# Altium project LPCB235__RLOOP__FCU.PrjPCB (part 1 of 7)
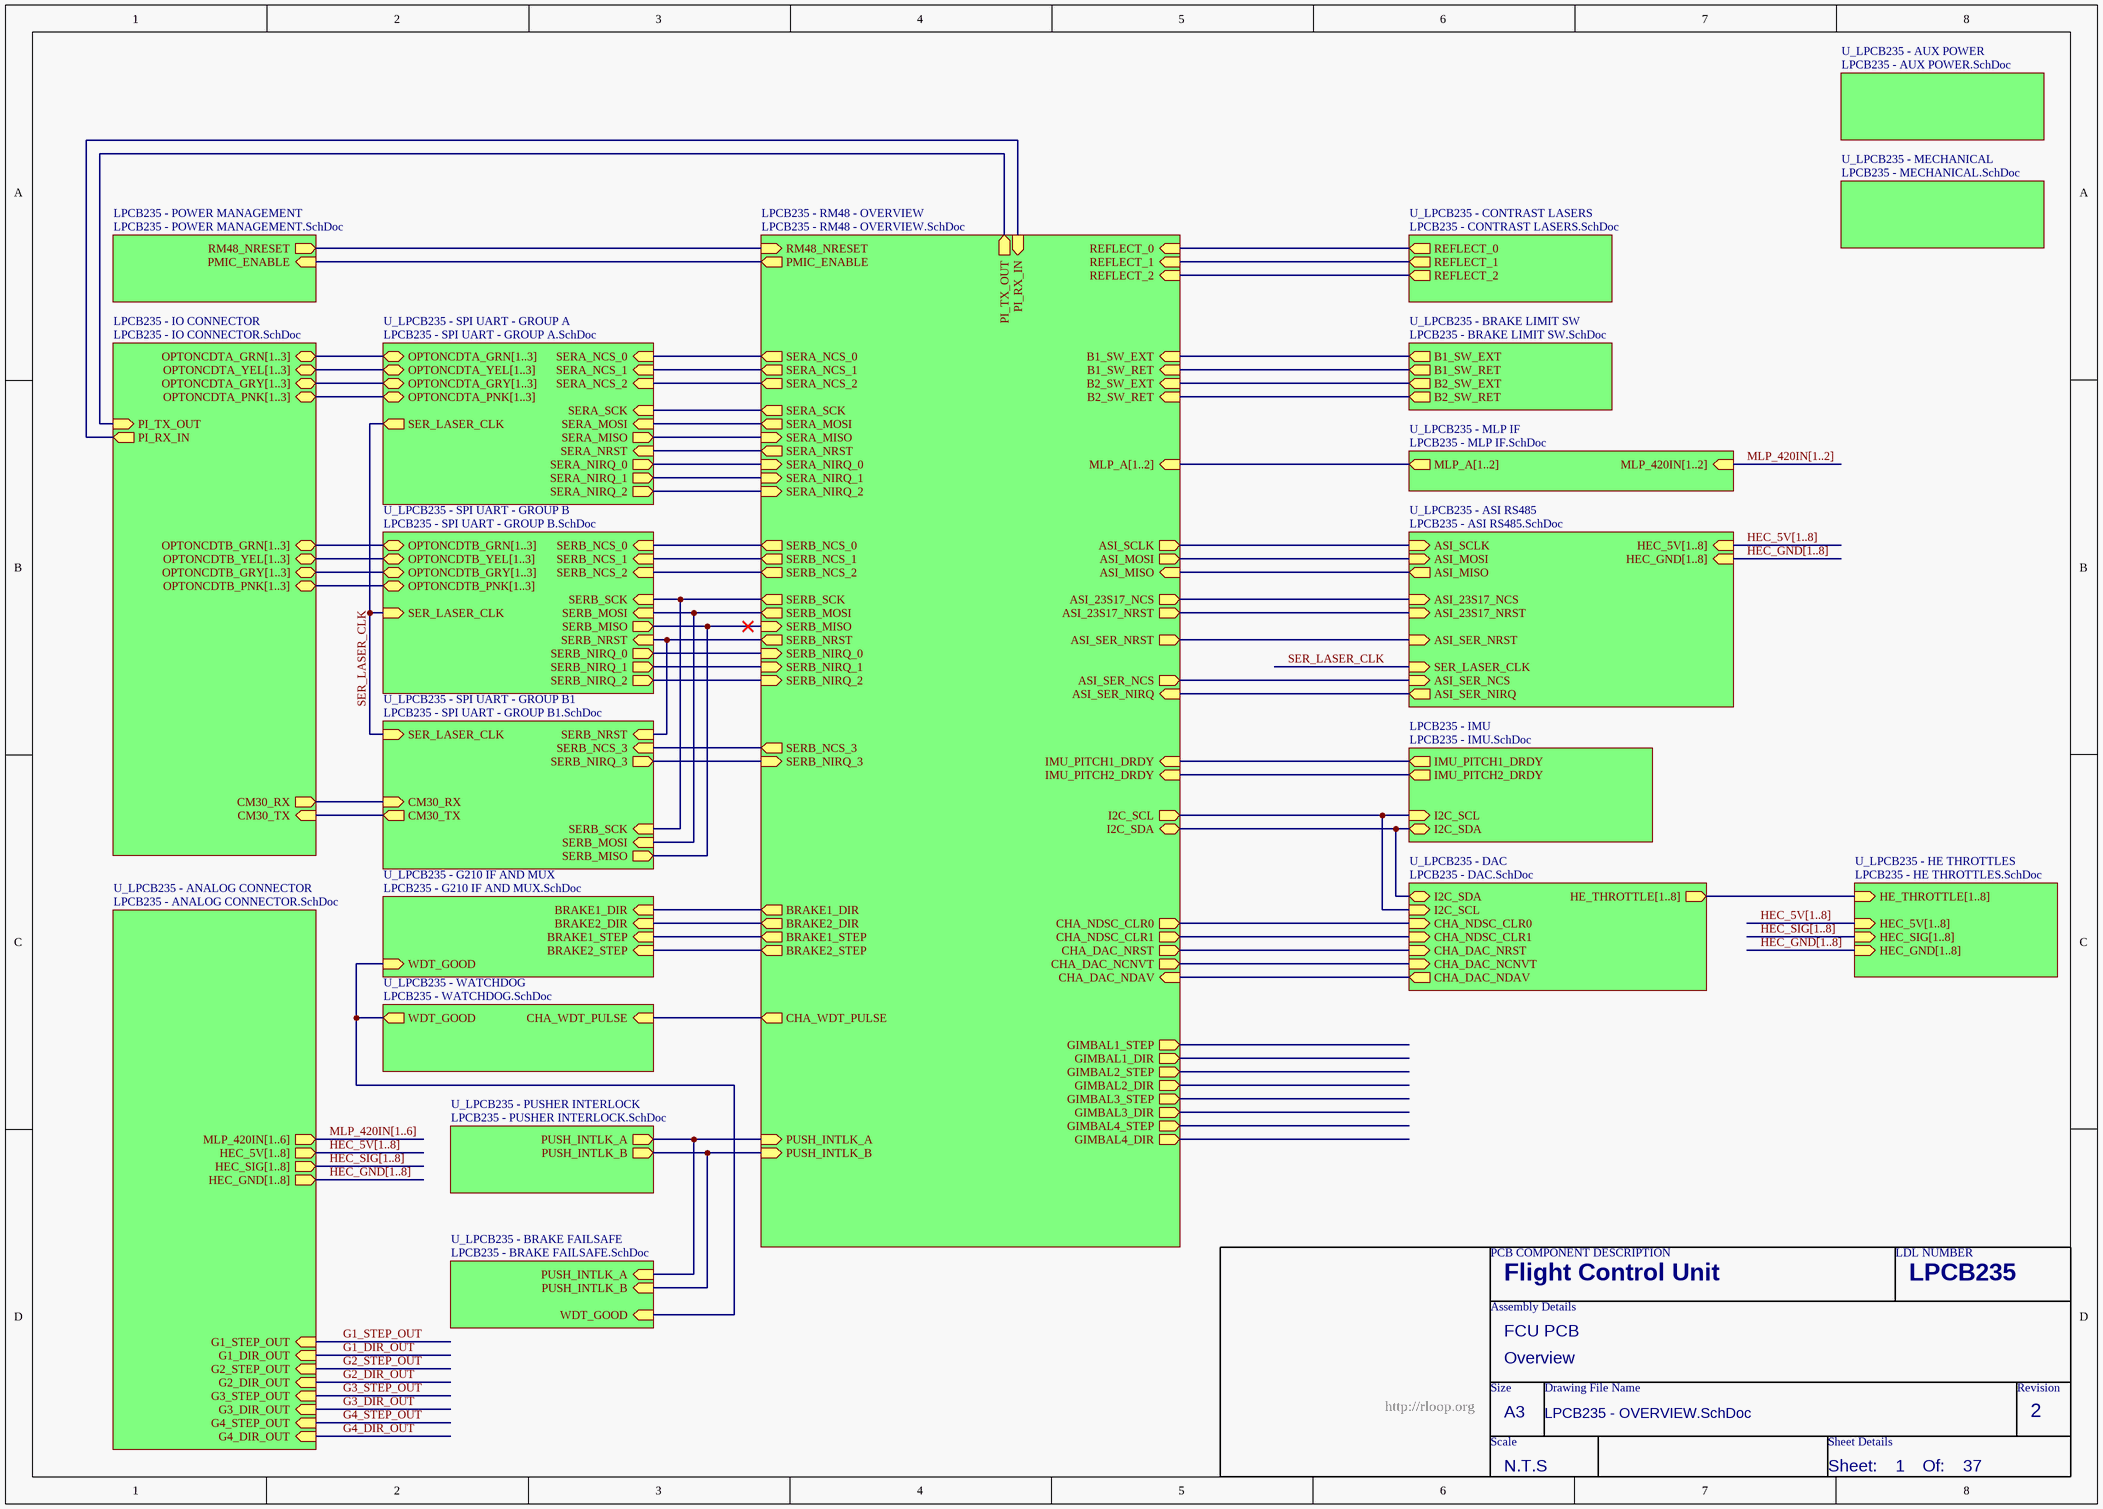
[diagram p0: LPCB235 - OVERVIEW.SchDoc]
37 sheets, 472 parts. Net scope: hierarchical (ports join the sheet entries above them; power ports are global).
Board files: LPCB235R0.PcbDoc, LPCB235R0__ASCII.PcbDoc
Sheets:
  LPCB235 - OVERVIEW.SchDoc
    LPCB235 - POWER MANAGEMENT = LPCB235 - POWER MANAGEMENT.SchDoc
    LPCB235 - IO CONNECTOR = LPCB235 - IO Connector.SchDoc
    LPCB235 - RM48 - OVERVIEW = LPCB235 - RM48 - OVERVIEW.SchDoc
      LPCB235 - RM48 - POWER = LPCB235 - RM48 - POWER.SchDoc
      LPCB235 - RM48 - ANALOG = LPCB235 - RM48 - ANALOG.SchDoc
      LPCB235 - RM48 - EMIF = LPCB235 - RM48 - EMIF.SchDoc
      LPCB235 - RM48 - MAIN = LPCB235 - RM48 - MAIN.SchDoc
      LPCB235 - CAN Interface = LPCB235 - CAN Interface.SchDoc
      LPCB235 - RM48 - SERIAL = LPCB235 - RM48 - SERIAL.SchDoc
      LPCB235 - RM48 - 100BASET = LPCB235 - RM48 - 100BASET.SchDoc
      LPCB235 - MAGNETICS = LPCB235 - MAGNETICS.SchDoc
      LPCB235 - RM48 - GIO = LPCB235 - RM48 - GIO.SchDoc
      LPCB235 - RM48 - N2HET = LPCB235 - RM48 - N2HET.SchDoc
    LPCB235 - IMU = LPCB235 - IMU.SchDoc
    U_LPCB235 - MECHANICAL = LPCB235 - MECHANICAL.SchDoc
    U_LPCB235 - SPI UART - GROUP B = LPCB235 - SPI UART - GROUP B.SchDoc
      OGB1 = LPCB235 - OPTONCDT - GROUP B.SchDoc
      OGB2 = LPCB235 - OPTONCDT - GROUP B.SchDoc
      OGB3 = LPCB235 - OPTONCDT - GROUP B.SchDoc
    U_LPCB235 - SPI UART - GROUP A = LPCB235 - SPI UART - GROUP A.SchDoc
      OGA1 = LPCB235 - OPTONCDT - GROUP A.SchDoc
      OGA2 = LPCB235 - OPTONCDT - GROUP A.SchDoc
      OGA3 = LPCB235 - OPTONCDT - GROUP A.SchDoc
    U_LPCB235 - SPI UART - GROUP B1 = LPCB235 - SPI UART - GROUP B1.SchDoc
    U_LPCB235 - DAC = LPCB235 - DAC.SchDoc
    U_LPCB235 - HE THROTTLES = LPCB235 - HE THROTTLES.SchDoc
      TH1 = LPCB235 - HE ISO CHANNEL.SchDoc
      TH2 = LPCB235 - HE ISO CHANNEL.SchDoc
      TH3 = LPCB235 - HE ISO CHANNEL.SchDoc
      TH4 = LPCB235 - HE ISO CHANNEL.SchDoc
      TH5 = LPCB235 - HE ISO CHANNEL.SchDoc
      TH6 = LPCB235 - HE ISO CHANNEL.SchDoc
      TH7 = LPCB235 - HE ISO CHANNEL.SchDoc
      TH8 = LPCB235 - HE ISO CHANNEL.SchDoc
    U_LPCB235 - WATCHDOG = LPCB235 - WATCHDOG.SchDoc
    U_LPCB235 - BRAKE FAILSAFE = LPCB235 - BRAKE FAILSAFE.SchDoc
    U_LPCB235 - ANALOG CONNECTOR = LPCB235 - ANALOG CONNECTOR.SchDoc
    U_LPCB235 - CONTRAST LASERS = LPCB235 - CONTRAST LASERS.SchDoc
    U_LPCB235 - PUSHER INTERLOCK = LPCB235 - PUSHER INTERLOCK.SchDoc
    U_LPCB235 - BRAKE LIMIT SW = LPCB235 - BRAKE LIMIT SW.SchDoc
    U_LPCB235 - AUX POWER = LPCB235 - AUX POWER.SchDoc
    U_LPCB235 - G210 IF AND MUX = LPCB235 - G210 IF AND MUX.SchDoc
    U_LPCB235 - MLP IF = LPCB235 - MLP IF.SchDoc
      ML1 = LPCB235 - MLP CHANNEL.SchDoc
      ML2 = LPCB235 - MLP CHANNEL.SchDoc
    U_LPCB235 - ASI RS485 = LPCB235 - ASI RS485.SchDoc
      U_LPCB235 - HEC1-4 = LPCB235 - HEC1-4.SchDoc
      U_LPCB235 - HEC5-8 = LPCB235 - HEC5-8.SchDoc

## Sheet LPCB235 - OVERVIEW.SchDoc
size A3; Address1: Unit 4; DocumentNumber: 1; Revision: 2; SheetNumber: 1; SheetTotal: 37; Lockie__PCB_SUB_ASSEMBLY: Overview; Lockie__PCB_ASSEMBLY: FCU PCB; Lockie__LDL: LPCB235; Lockie__PCB_DESCRIPTION: Flight Control Unit

### Sub-sheets
LPCB235 - IMU = LPCB235 - IMU.SchDoc: IMU_PITCH1_DRDY (out), IMU_PITCH2_DRDY (out), I2C_SCL (in), I2C_SDA (bidir)
LPCB235 - IO CONNECTOR = LPCB235 - IO CONNECTOR.SchDoc: OPTONCDTA_GRN[1..3] (bidir), OPTONCDTA_YEL[1..3] (bidir), OPTONCDTA_GRY[1..3] (bidir), OPTONCDTA_PNK[1..3] (bidir), OPTONCDTB_GRN[1..3] (bidir), OPTONCDTB_YEL[1..3] (bidir), OPTONCDTB_GRY[1..3] (bidir), OPTONCDTB_PNK[1..3] (bidir), CM30_RX (out), CM30_TX (in), PI_TX_OUT (in), PI_RX_IN (out)
LPCB235 - POWER MANAGEMENT = LPCB235 - POWER MANAGEMENT.SchDoc: PMIC_ENABLE (in), RM48_NRESET (out)
LPCB235 - RM48 - OVERVIEW = LPCB235 - RM48 - OVERVIEW.SchDoc: RM48_NRESET (in), PMIC_ENABLE (out), SERA_NRST (out), SERB_NRST (out), REFLECT_0 (in), REFLECT_1 (in), REFLECT_2 (in), MLP_A[1..2] (in), SERA_NIRQ_0 (in), SERA_NIRQ_1 (in), SERA_NIRQ_2 (in), SERA_NCS_0 (out), SERA_NCS_1 (out), SERA_NCS_2 (out), SERA_MISO (in), SERA_MOSI (out), SERA_SCK (out), IMU_PITCH1_DRDY (in), IMU_PITCH2_DRDY (in), SERB_MISO (in), SERB_MOSI (out), SERB_SCK (out), BRAKE2_DIR (out), BRAKE1_DIR (out), BRAKE2_STEP (out), BRAKE1_STEP (out), SERB_NCS_0 (out), SERB_NCS_1 (out), SERB_NIRQ_1 (in), CHA_WDT_PULSE (out), SERB_NIRQ_0 (in), I2C_SCL (out), I2C_SDA (bidir), PUSH_INTLK_A (in), B2_SW_EXT (in), SERB_NCS_2 (out), SERB_NCS_3 (out), SERB_NIRQ_2 (in), SERB_NIRQ_3 (in), PUSH_INTLK_B (in), B2_SW_RET (in), CHA_DAC_NDAV (in), B1_SW_EXT (in), B1_SW_RET (in), CHA_DAC_NRST (out), CHA_NDSC_CLR0 (out), CHA_NDSC_CLR1 (out), PI_TX_OUT (out), PI_RX_IN (in), CHA_DAC_NCNVT (out), ASI_MISO (in), ASI_MOSI (out), ASI_SCLK (out), ASI_23S17_NCS (out), ASI_23S17_NRST (out), ASI_SER_NCS (out), ASI_SER_NIRQ (in), ASI_SER_NRST (out), GIMBAL1_STEP (out), GIMBAL1_DIR (out), GIMBAL2_STEP (out), GIMBAL2_DIR (out), GIMBAL3_STEP (out), GIMBAL3_DIR (out), GIMBAL4_STEP (out), GIMBAL4_DIR (out)
U_LPCB235 - ANALOG CONNECTOR = LPCB235 - ANALOG CONNECTOR.SchDoc: HEC_5V[1..8] (out), HEC_SIG[1..8] (out), HEC_GND[1..8] (out), MLP_420IN[1..6] (out), G1_STEP_OUT (in), G1_DIR_OUT (in), G2_STEP_OUT (in), G2_DIR_OUT (in), G3_STEP_OUT (in), G3_DIR_OUT (in), G4_STEP_OUT (in), G4_DIR_OUT (in)
U_LPCB235 - ASI RS485 = LPCB235 - ASI RS485.SchDoc: ASI_SCLK (in), ASI_MOSI (in), ASI_MISO (out), ASI_23S17_NCS (in), ASI_23S17_NRST (in), SER_LASER_CLK (in), ASI_SER_NCS (in), ASI_SER_NRST (in), ASI_SER_NIRQ (out), HEC_5V[1..8] (in), HEC_GND[1..8] (in)
U_LPCB235 - AUX POWER = LPCB235 - AUX POWER.SchDoc: no entries
U_LPCB235 - BRAKE FAILSAFE = LPCB235 - BRAKE FAILSAFE.SchDoc: PUSH_INTLK_A (in), PUSH_INTLK_B (in), WDT_GOOD (in)
U_LPCB235 - BRAKE LIMIT SW = LPCB235 - BRAKE LIMIT SW.SchDoc: B1_SW_EXT (out), B1_SW_RET (out), B2_SW_EXT (out), B2_SW_RET (out)
U_LPCB235 - CONTRAST LASERS = LPCB235 - CONTRAST LASERS.SchDoc: REFLECT_0 (out), REFLECT_1 (out), REFLECT_2 (out)
U_LPCB235 - DAC = LPCB235 - DAC.SchDoc: HE_THROTTLE[1..8] (out), I2C_SDA (bidir), I2C_SCL (in), CHA_NDSC_CLR0 (in), CHA_NDSC_CLR1 (in), CHA_DAC_NRST (in), CHA_DAC_NDAV (out), CHA_DAC_NCNVT (in)
U_LPCB235 - G210 IF AND MUX = LPCB235 - G210 IF AND MUX.SchDoc: BRAKE1_DIR (in), BRAKE2_DIR (in), BRAKE1_STEP (in), BRAKE2_STEP (in), WDT_GOOD (in)
U_LPCB235 - HE THROTTLES = LPCB235 - HE THROTTLES.SchDoc: HE_THROTTLE[1..8] (in), HEC_5V[1..8] (in), HEC_SIG[1..8] (in), HEC_GND[1..8] (in)
U_LPCB235 - MECHANICAL = LPCB235 - MECHANICAL.SchDoc: no entries
U_LPCB235 - MLP IF = LPCB235 - MLP IF.SchDoc: MLP_A[1..2] (out), MLP_420IN[1..2] (in)
U_LPCB235 - PUSHER INTERLOCK = LPCB235 - PUSHER INTERLOCK.SchDoc: PUSH_INTLK_A (out), PUSH_INTLK_B (out)
U_LPCB235 - SPI UART - GROUP A = LPCB235 - SPI UART - GROUP A.SchDoc: SERA_NCS_0 (in), SERA_NCS_1 (in), SERA_NCS_2 (in), SERA_NRST (in), SERA_NIRQ_0 (out), SERA_NIRQ_1 (out), SERA_NIRQ_2 (out), SERA_SCK (in), SERA_MOSI (in), SERA_MISO (out), OPTONCDTA_GRN[1..3] (bidir), OPTONCDTA_YEL[1..3] (bidir), OPTONCDTA_GRY[1..3] (bidir), OPTONCDTA_PNK[1..3] (bidir), SER_LASER_CLK (out)
U_LPCB235 - SPI UART - GROUP B = LPCB235 - SPI UART - GROUP B.SchDoc: SERB_NCS_0 (in), SERB_NCS_1 (in), SERB_NCS_2 (in), SERB_NRST (in), SERB_NIRQ_0 (out), SERB_NIRQ_1 (out), SERB_NIRQ_2 (out), SERB_SCK (in), SERB_MOSI (in), SERB_MISO (out), OPTONCDTB_GRN[1..3] (bidir), OPTONCDTB_YEL[1..3] (bidir), OPTONCDTB_GRY[1..3] (bidir), OPTONCDTB_PNK[1..3] (bidir), SER_LASER_CLK (in)
U_LPCB235 - SPI UART - GROUP B1 = LPCB235 - SPI UART - GROUP B1.SchDoc: SERB_NCS_3 (in), SERB_NRST (in), SERB_NIRQ_3 (out), SERB_SCK (in), SERB_MOSI (in), SERB_MISO (out), SER_LASER_CLK (in), CM30_RX (in), CM30_TX (out)
U_LPCB235 - WATCHDOG = LPCB235 - WATCHDOG.SchDoc: CHA_WDT_PULSE (in), WDT_GOOD (out)

### Nets
ASI_23S17_NCS: sheet LPCB235 - RM48 - OVERVIEW/ASI_23S17_NCS, sheet U_LPCB235 - ASI RS485/ASI_23S17_NCS
ASI_23S17_NRST: sheet LPCB235 - RM48 - OVERVIEW/ASI_23S17_NRST, sheet U_LPCB235 - ASI RS485/ASI_23S17_NRST
ASI_MISO: sheet LPCB235 - RM48 - OVERVIEW/ASI_MISO, sheet U_LPCB235 - ASI RS485/ASI_MISO
ASI_MOSI: sheet LPCB235 - RM48 - OVERVIEW/ASI_MOSI, sheet U_LPCB235 - ASI RS485/ASI_MOSI
ASI_SCLK: sheet LPCB235 - RM48 - OVERVIEW/ASI_SCLK, sheet U_LPCB235 - ASI RS485/ASI_SCLK
ASI_SER_NCS: sheet LPCB235 - RM48 - OVERVIEW/ASI_SER_NCS, sheet U_LPCB235 - ASI RS485/ASI_SER_NCS
ASI_SER_NIRQ: sheet LPCB235 - RM48 - OVERVIEW/ASI_SER_NIRQ, sheet U_LPCB235 - ASI RS485/ASI_SER_NIRQ
ASI_SER_NRST: sheet LPCB235 - RM48 - OVERVIEW/ASI_SER_NRST, sheet U_LPCB235 - ASI RS485/ASI_SER_NRST
B1_SW_EXT: sheet LPCB235 - RM48 - OVERVIEW/B1_SW_EXT, sheet U_LPCB235 - BRAKE LIMIT SW/B1_SW_EXT
B1_SW_RET: sheet LPCB235 - RM48 - OVERVIEW/B1_SW_RET, sheet U_LPCB235 - BRAKE LIMIT SW/B1_SW_RET
B2_SW_EXT: sheet LPCB235 - RM48 - OVERVIEW/B2_SW_EXT, sheet U_LPCB235 - BRAKE LIMIT SW/B2_SW_EXT
B2_SW_RET: sheet LPCB235 - RM48 - OVERVIEW/B2_SW_RET, sheet U_LPCB235 - BRAKE LIMIT SW/B2_SW_RET
BRAKE1_DIR: sheet LPCB235 - RM48 - OVERVIEW/BRAKE1_DIR, sheet U_LPCB235 - G210 IF AND MUX/BRAKE1_DIR
BRAKE1_STEP: sheet LPCB235 - RM48 - OVERVIEW/BRAKE1_STEP, sheet U_LPCB235 - G210 IF AND MUX/BRAKE1_STEP
BRAKE2_DIR: sheet LPCB235 - RM48 - OVERVIEW/BRAKE2_DIR, sheet U_LPCB235 - G210 IF AND MUX/BRAKE2_DIR
BRAKE2_STEP: sheet LPCB235 - RM48 - OVERVIEW/BRAKE2_STEP, sheet U_LPCB235 - G210 IF AND MUX/BRAKE2_STEP
CHA_DAC_NCNVT: sheet LPCB235 - RM48 - OVERVIEW/CHA_DAC_NCNVT, sheet U_LPCB235 - DAC/CHA_DAC_NCNVT
CHA_DAC_NDAV: sheet LPCB235 - RM48 - OVERVIEW/CHA_DAC_NDAV, sheet U_LPCB235 - DAC/CHA_DAC_NDAV
CHA_DAC_NRST: sheet LPCB235 - RM48 - OVERVIEW/CHA_DAC_NRST, sheet U_LPCB235 - DAC/CHA_DAC_NRST
CHA_NDSC_CLR0: sheet LPCB235 - RM48 - OVERVIEW/CHA_NDSC_CLR0, sheet U_LPCB235 - DAC/CHA_NDSC_CLR0
CHA_NDSC_CLR1: sheet LPCB235 - RM48 - OVERVIEW/CHA_NDSC_CLR1, sheet U_LPCB235 - DAC/CHA_NDSC_CLR1
CHA_WDT_PULSE: sheet LPCB235 - RM48 - OVERVIEW/CHA_WDT_PULSE, sheet U_LPCB235 - WATCHDOG/CHA_WDT_PULSE
CM30_RX: sheet LPCB235 - IO CONNECTOR/CM30_RX, sheet U_LPCB235 - SPI UART - GROUP B1/CM30_RX
CM30_TX: sheet LPCB235 - IO CONNECTOR/CM30_TX, sheet U_LPCB235 - SPI UART - GROUP B1/CM30_TX
I2C_SCL: sheet LPCB235 - RM48 - OVERVIEW/I2C_SCL, sheet LPCB235 - IMU/I2C_SCL, sheet U_LPCB235 - DAC/I2C_SCL
I2C_SDA: sheet LPCB235 - RM48 - OVERVIEW/I2C_SDA, sheet LPCB235 - IMU/I2C_SDA, sheet U_LPCB235 - DAC/I2C_SDA
IMU_PITCH1_DRDY: sheet LPCB235 - RM48 - OVERVIEW/IMU_PITCH1_DRDY, sheet LPCB235 - IMU/IMU_PITCH1_DRDY
IMU_PITCH2_DRDY: sheet LPCB235 - RM48 - OVERVIEW/IMU_PITCH2_DRDY, sheet LPCB235 - IMU/IMU_PITCH2_DRDY
PI_RX_IN: sheet LPCB235 - IO CONNECTOR/PI_RX_IN, sheet LPCB235 - RM48 - OVERVIEW/PI_RX_IN
PI_TX_OUT: sheet LPCB235 - IO CONNECTOR/PI_TX_OUT, sheet LPCB235 - RM48 - OVERVIEW/PI_TX_OUT
PMIC_ENABLE: sheet LPCB235 - POWER MANAGEMENT/PMIC_ENABLE, sheet LPCB235 - RM48 - OVERVIEW/PMIC_ENABLE
PUSH_INTLK_A: sheet LPCB235 - RM48 - OVERVIEW/PUSH_INTLK_A, sheet U_LPCB235 - BRAKE FAILSAFE/PUSH_INTLK_A, sheet U_LPCB235 - PUSHER INTERLOCK/PUSH_INTLK_A
PUSH_INTLK_B: sheet LPCB235 - RM48 - OVERVIEW/PUSH_INTLK_B, sheet U_LPCB235 - BRAKE FAILSAFE/PUSH_INTLK_B, sheet U_LPCB235 - PUSHER INTERLOCK/PUSH_INTLK_B
REFLECT_0: sheet LPCB235 - RM48 - OVERVIEW/REFLECT_0, sheet U_LPCB235 - CONTRAST LASERS/REFLECT_0
REFLECT_1: sheet LPCB235 - RM48 - OVERVIEW/REFLECT_1, sheet U_LPCB235 - CONTRAST LASERS/REFLECT_1
REFLECT_2: sheet LPCB235 - RM48 - OVERVIEW/REFLECT_2, sheet U_LPCB235 - CONTRAST LASERS/REFLECT_2
RM48_NRESET: sheet LPCB235 - POWER MANAGEMENT/RM48_NRESET, sheet LPCB235 - RM48 - OVERVIEW/RM48_NRESET
SER_LASER_CLK: sheet U_LPCB235 - SPI UART - GROUP B/SER_LASER_CLK, sheet U_LPCB235 - SPI UART - GROUP A/SER_LASER_CLK, sheet U_LPCB235 - SPI UART - GROUP B1/SER_LASER_CLK, sheet U_LPCB235 - ASI RS485/SER_LASER_CLK
SERA_MISO: sheet LPCB235 - RM48 - OVERVIEW/SERA_MISO, sheet U_LPCB235 - SPI UART - GROUP A/SERA_MISO
SERA_MOSI: sheet LPCB235 - RM48 - OVERVIEW/SERA_MOSI, sheet U_LPCB235 - SPI UART - GROUP A/SERA_MOSI
SERA_NCS_0: sheet LPCB235 - RM48 - OVERVIEW/SERA_NCS_0, sheet U_LPCB235 - SPI UART - GROUP A/SERA_NCS_0
SERA_NCS_1: sheet LPCB235 - RM48 - OVERVIEW/SERA_NCS_1, sheet U_LPCB235 - SPI UART - GROUP A/SERA_NCS_1
SERA_NCS_2: sheet LPCB235 - RM48 - OVERVIEW/SERA_NCS_2, sheet U_LPCB235 - SPI UART - GROUP A/SERA_NCS_2
SERA_NIRQ_0: sheet LPCB235 - RM48 - OVERVIEW/SERA_NIRQ_0, sheet U_LPCB235 - SPI UART - GROUP A/SERA_NIRQ_0
SERA_NIRQ_1: sheet LPCB235 - RM48 - OVERVIEW/SERA_NIRQ_1, sheet U_LPCB235 - SPI UART - GROUP A/SERA_NIRQ_1
SERA_NIRQ_2: sheet LPCB235 - RM48 - OVERVIEW/SERA_NIRQ_2, sheet U_LPCB235 - SPI UART - GROUP A/SERA_NIRQ_2
SERA_NRST: sheet LPCB235 - RM48 - OVERVIEW/SERA_NRST, sheet U_LPCB235 - SPI UART - GROUP A/SERA_NRST
SERA_SCK: sheet LPCB235 - RM48 - OVERVIEW/SERA_SCK, sheet U_LPCB235 - SPI UART - GROUP A/SERA_SCK
SERB_MISO: sheet LPCB235 - RM48 - OVERVIEW/SERB_MISO, sheet U_LPCB235 - SPI UART - GROUP B/SERB_MISO, sheet U_LPCB235 - SPI UART - GROUP B1/SERB_MISO
SERB_MOSI: sheet LPCB235 - RM48 - OVERVIEW/SERB_MOSI, sheet U_LPCB235 - SPI UART - GROUP B/SERB_MOSI, sheet U_LPCB235 - SPI UART - GROUP B1/SERB_MOSI
SERB_NCS_0: sheet LPCB235 - RM48 - OVERVIEW/SERB_NCS_0, sheet U_LPCB235 - SPI UART - GROUP B/SERB_NCS_0
SERB_NCS_1: sheet LPCB235 - RM48 - OVERVIEW/SERB_NCS_1, sheet U_LPCB235 - SPI UART - GROUP B/SERB_NCS_1
SERB_NCS_2: sheet LPCB235 - RM48 - OVERVIEW/SERB_NCS_2, sheet U_LPCB235 - SPI UART - GROUP B/SERB_NCS_2
SERB_NCS_3: sheet LPCB235 - RM48 - OVERVIEW/SERB_NCS_3, sheet U_LPCB235 - SPI UART - GROUP B1/SERB_NCS_3
SERB_NIRQ_0: sheet LPCB235 - RM48 - OVERVIEW/SERB_NIRQ_0, sheet U_LPCB235 - SPI UART - GROUP B/SERB_NIRQ_0
SERB_NIRQ_1: sheet LPCB235 - RM48 - OVERVIEW/SERB_NIRQ_1, sheet U_LPCB235 - SPI UART - GROUP B/SERB_NIRQ_1
SERB_NIRQ_2: sheet LPCB235 - RM48 - OVERVIEW/SERB_NIRQ_2, sheet U_LPCB235 - SPI UART - GROUP B/SERB_NIRQ_2
SERB_NIRQ_3: sheet LPCB235 - RM48 - OVERVIEW/SERB_NIRQ_3, sheet U_LPCB235 - SPI UART - GROUP B1/SERB_NIRQ_3
SERB_NRST: sheet LPCB235 - RM48 - OVERVIEW/SERB_NRST, sheet U_LPCB235 - SPI UART - GROUP B/SERB_NRST, sheet U_LPCB235 - SPI UART - GROUP B1/SERB_NRST
SERB_SCK: sheet LPCB235 - RM48 - OVERVIEW/SERB_SCK, sheet U_LPCB235 - SPI UART - GROUP B/SERB_SCK, sheet U_LPCB235 - SPI UART - GROUP B1/SERB_SCK
WDT_GOOD: sheet U_LPCB235 - WATCHDOG/WDT_GOOD, sheet U_LPCB235 - BRAKE FAILSAFE/WDT_GOOD, sheet U_LPCB235 - G210 IF AND MUX/WDT_GOOD

### Buses and harness runs
bus HEC_5V[1..8] = sheet U_LPCB235 - ANALOG CONNECTOR/HEC_5V[1..8]
bus HEC_5V[1..8] = sheet U_LPCB235 - ASI RS485/HEC_5V[1..8]
bus HEC_5V[1..8] = sheet U_LPCB235 - HE THROTTLES/HEC_5V[1..8]
bus HEC_GND[1..8] = sheet U_LPCB235 - ANALOG CONNECTOR/HEC_GND[1..8]
bus HEC_GND[1..8] = sheet U_LPCB235 - ASI RS485/HEC_GND[1..8]
bus HEC_GND[1..8] = sheet U_LPCB235 - HE THROTTLES/HEC_GND[1..8]
bus HEC_SIG[1..8] = sheet U_LPCB235 - ANALOG CONNECTOR/HEC_SIG[1..8]
bus HEC_SIG[1..8] = sheet U_LPCB235 - HE THROTTLES/HEC_SIG[1..8]
bus MLP_420IN[1..2] = sheet U_LPCB235 - MLP IF/MLP_420IN[1..2]
bus MLP_420IN[1..6] = sheet U_LPCB235 - ANALOG CONNECTOR/MLP_420IN[1..6]
bus sheet LPCB235 - IO CONNECTOR/OPTONCDTA_GRN[1..3] = sheet U_LPCB235 - SPI UART - GROUP A/OPTONCDTA_GRN[1..3]
bus sheet LPCB235 - IO CONNECTOR/OPTONCDTA_GRY[1..3] = sheet U_LPCB235 - SPI UART - GROUP A/OPTONCDTA_GRY[1..3]
bus sheet LPCB235 - IO CONNECTOR/OPTONCDTA_PNK[1..3] = sheet U_LPCB235 - SPI UART - GROUP A/OPTONCDTA_PNK[1..3]
bus sheet LPCB235 - IO CONNECTOR/OPTONCDTA_YEL[1..3] = sheet U_LPCB235 - SPI UART - GROUP A/OPTONCDTA_YEL[1..3]
bus sheet LPCB235 - IO CONNECTOR/OPTONCDTB_GRN[1..3] = sheet U_LPCB235 - SPI UART - GROUP B/OPTONCDTB_GRN[1..3]
bus sheet LPCB235 - IO CONNECTOR/OPTONCDTB_GRY[1..3] = sheet U_LPCB235 - SPI UART - GROUP B/OPTONCDTB_GRY[1..3]
bus sheet LPCB235 - IO CONNECTOR/OPTONCDTB_PNK[1..3] = sheet U_LPCB235 - SPI UART - GROUP B/OPTONCDTB_PNK[1..3]
bus sheet LPCB235 - IO CONNECTOR/OPTONCDTB_YEL[1..3] = sheet U_LPCB235 - SPI UART - GROUP B/OPTONCDTB_YEL[1..3]
bus sheet LPCB235 - RM48 - OVERVIEW/MLP_A[1..2] = sheet U_LPCB235 - MLP IF/MLP_A[1..2]
bus sheet U_LPCB235 - DAC/HE_THROTTLE[1..8] = sheet U_LPCB235 - HE THROTTLES/HE_THROTTLE[1..8]

### Notes on the sheet
- PCB COMPONENT DESCRIPTION
- LDL NUMBER
- Assembly Details
- Size
- Drawing File Name
- Revision
- http://rloop.org
- Scale
- A3
- Sheet Details
- N.T.S
- Sheet:
- Of:

## Sheet LPCB235 - POWER MANAGEMENT.SchDoc
size A3; Address1: Unit 4; DocumentNumber: 19; Revision: 2; SheetNumber: 19; SheetTotal: 37; Lockie__PCB_SUB_ASSEMBLY: Power Management; Lockie__PCB_ASSEMBLY: FCU PCB; Lockie__LDL: LPCB235; Lockie__PCB_DESCRIPTION: Flight Control Unit
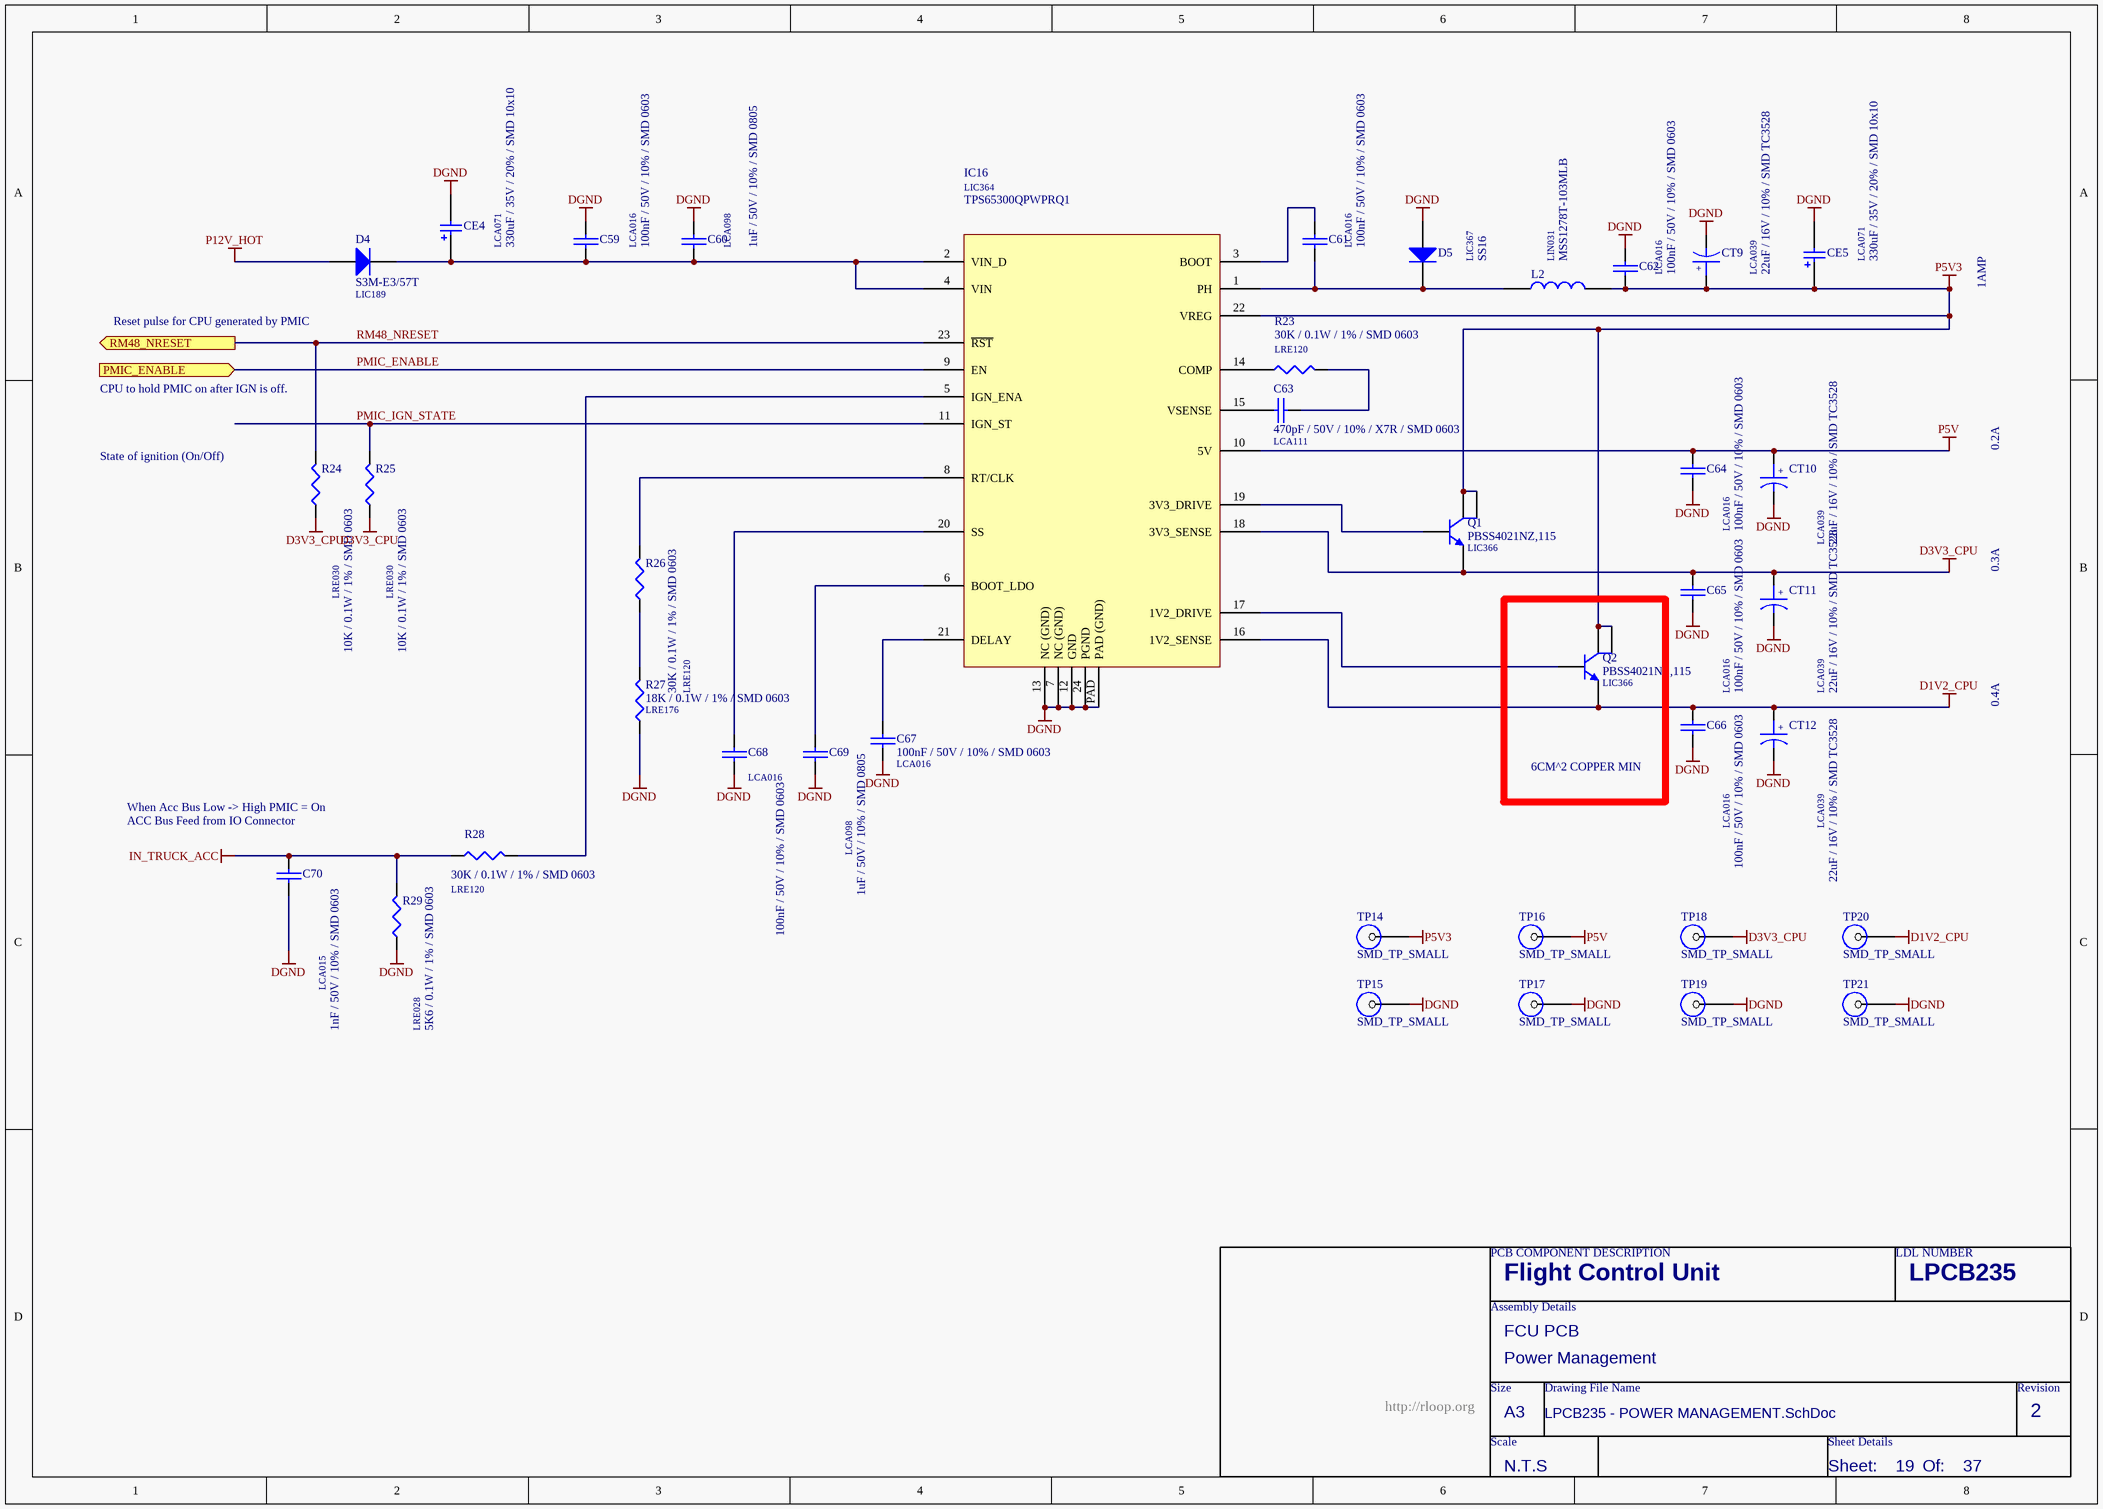
[diagram p1: LPCB235 - POWER MANAGEMENT.SchDoc]

### Parts
C59  100nF / 50V / 10% / SMD 0603  LDL_NUMBER: LCA016  [LFP011__CC1608-0603-IPC7351_B]
C60  1uF / 50V / 10% / SMD 0805  LDL_NUMBER: LCA098  [LFP010__CC2012-0805-IPC7351_B]
C61  100nF / 50V / 10% / SMD 0603  LDL_NUMBER: LCA016  [LFP011__CC1608-0603-IPC7351_B]
C62  100nF / 50V / 10% / SMD 0603  LDL_NUMBER: LCA016  [LFP011__CC1608-0603-IPC7351_B]
C63  470pF / 50V / 10% / X7R / SMD 0603  LDL_NUMBER: LCA111  [LFP011__CC1608-0603-IPC7351_B]
C64  100nF / 50V / 10% / SMD 0603  LDL_NUMBER: LCA016  [LFP011__CC1608-0603-IPC7351_B]
C65  100nF / 50V / 10% / SMD 0603  LDL_NUMBER: LCA016  [LFP011__CC1608-0603-IPC7351_B]
C66  100nF / 50V / 10% / SMD 0603  LDL_NUMBER: LCA016  [LFP011__CC1608-0603-IPC7351_B]
C67  100nF / 50V / 10% / SMD 0603  LDL_NUMBER: LCA016  [LFP011__CC1608-0603-IPC7351_B]
C68  100nF / 50V / 10% / SMD 0603  LDL_NUMBER: LCA016  [LFP011__CC1608-0603-IPC7351_B]
C69  1uF / 50V / 10% / SMD 0805  LDL_NUMBER: LCA098  [LFP010__CC2012-0805-IPC7351_B]
C70  1nF / 50V / 10% / SMD 0603  LDL_NUMBER: LCA015  [LFP011__CC1608-0603-IPC7351_B]
CE4  330uF / 35V / 20% / SMD 10x10  LDL_NUMBER: LCA071  [LFP041__NICHICON_WT_10X10]
CE5  330uF / 35V / 20% / SMD 10x10  LDL_NUMBER: LCA071  [LFP041__NICHICON_WT_10X10]
CT9  22uF / 16V / 10% / SMD TC3528  LDL_NUMBER: LCA039  [LFP018__TC3528]
CT10  22uF / 16V / 10% / SMD TC3528  LDL_NUMBER: LCA039  [LFP018__TC3528]
CT11  22uF / 16V / 10% / SMD TC3528  LDL_NUMBER: LCA039  [LFP018__TC3528]
CT12  22uF / 16V / 10% / SMD TC3528  LDL_NUMBER: LCA039  [LFP018__TC3528]
D4  S3M-E3/57T  LDL_NUMBER: LIC189  [LFP040__DO-214AB]
D5  SS16  LDL_NUMBER: LIC367  [LFP039__DO-214AC]
IC16  TPS65300QPWPRQ1  LDL_NUMBER: LIC364  [LFP036__R-PDSO-G24]
L2  MSS1278T-103MLB  LDL_NUMBER: LIN031  [LFP037__MSS1278T]
Q1  PBSS4021NZ,115  LDL_NUMBER: LIC366  [LFP038__SOT223-4M]
Q2  PBSS4021NZ,115  LDL_NUMBER: LIC366  [LFP038__SOT223-4M]
R23  30K / 0.1W / 1% / SMD 0603  LDL_NUMBER: LRE120  [LFP020__CR1608-0603-IPC7351_B]
R24  10K / 0.1W / 1% / SMD 0603  LDL_NUMBER: LRE030  [LFP020__CR1608-0603-IPC7351_B]
R25  10K / 0.1W / 1% / SMD 0603  LDL_NUMBER: LRE030  [LFP020__CR1608-0603-IPC7351_B]
R26  30K / 0.1W / 1% / SMD 0603  LDL_NUMBER: LRE120  [LFP020__CR1608-0603-IPC7351_B]
R27  18K / 0.1W / 1% / SMD 0603  LDL_NUMBER: LRE176  [LFP020__CR1608-0603-IPC7351_B]
R28  30K / 0.1W / 1% / SMD 0603  LDL_NUMBER: LRE120  [LFP020__CR1608-0603-IPC7351_B]
R29  5K6 / 0.1W / 1% / SMD 0603  LDL_NUMBER: LRE028  [LFP020__CR1608-0603-IPC7351_B]
TP14  SMD_TP_SMALL  [SMD-TP-SMALL]  (no BOM)
TP15  SMD_TP_SMALL  [SMD-TP-SMALL]  (no BOM)
TP16  SMD_TP_SMALL  [SMD-TP-SMALL]  (no BOM)
TP17  SMD_TP_SMALL  [SMD-TP-SMALL]  (no BOM)
TP18  SMD_TP_SMALL  [SMD-TP-SMALL]  (no BOM)
TP19  SMD_TP_SMALL  [SMD-TP-SMALL]  (no BOM)
TP20  SMD_TP_SMALL  [SMD-TP-SMALL]  (no BOM)
TP21  SMD_TP_SMALL  [SMD-TP-SMALL]  (no BOM)

### Blocks framed on the sheet
6CM^2 COPPER MIN: Q2

### Ports
PMIC_ENABLE (in), RM48_NRESET (out)

### Nets
D1V2_CPU: C66.1 CT12.1 IC16.16(1V2_SENSE) Q2.3(E) TP20.1
D3V3_CPU: C65.1 CT11.1 IC16.18(3V3_SENSE) Q1.3(E) R24.1 R25.1 TP18.1
DGND: C59.2 C60.2 C62.1 C64.2 C65.2 C66.2 C67.2 C68.1 C69.2 C70.2 CE4.2 CE5.2 CT9.2 CT10.2 CT11.2 CT12.2 D5.2(A) IC16.7(NC_(GND)) IC16.12(GND) IC16.13(NC_(GND)) IC16.24(PGND) IC16.PAD(PAD_(GND)) R27.1 R29.1 TP15.1 TP17.1 TP19.1 TP21.1
IN_TRUCK_ACC: C70.1 R28.1 R29.2
P5V: C64.1 CT10.1 IC16.10(5V) TP16.1
P5V3: C62.2 CE5.1 CT9.1 IC16.22(VREG) L2.2 Q1.2(C) Q1.4(C) Q2.2(C) Q2.4(C) TP14.1
P12V_HOT: D4.2(A)
PMIC_ENABLE: IC16.9(EN) ; port PMIC_ENABLE
PMIC_IGN_STATE: IC16.11(IGN_ST) R25.2
RM48_NRESET: IC16.23(~{RST}) R24.2 ; port RM48_NRESET
NetC59_1: C59.1 C60.1 CE4.1 D4.1(K) IC16.2(VIN_D) IC16.4(VIN)
NetC61_1: C61.1 D5.1(K) IC16.1(PH) L2.1
NetC61_2: C61.2 IC16.3(BOOT)
NetC63_1: C63.1 IC16.15(VSENSE)
NetC63_2: C63.2 R23.2
NetC67_1: C67.1 IC16.21(DELAY)
NetC68_2: C68.2 IC16.20(SS)
NetC69_1: C69.1 IC16.6(BOOT_LDO)
NetIC16_5: IC16.5(IGN_ENA) R28.2
NetIC16_8: IC16.8(RT/CLK) R26.2
NetIC16_14: IC16.14(COMP) R23.1
NetIC16_17: IC16.17(1V2_DRIVE) Q2.1(B)
NetIC16_19: IC16.19(3V3_DRIVE) Q1.1(B)
NetR26_1: R26.1 R27.2

### Notes on the sheet
- 1AMP
- Reset pulse for CPU generated by PMIC
- CPU to hold PMIC on after IGN is off.
- 0.2A
- State of ignition (On/Off)
- 0.3A
- 0.4A
- When Acc Bus Low -> High PMIC = On
- (near C70) ACC Bus Feed from IO Connector
- PCB COMPONENT DESCRIPTION
- LDL NUMBER
- Assembly Details
- Size
- Drawing File Name
- Revision
- http://rloop.org
- Scale
- A3
- Sheet Details
- N.T.S
- Sheet:
- Of:
- (in symbol 22uF / 16V / 10% / SMD TC3528) +

### Library data of the parts
C59 C61 C62 C64-C66 = 100nF / 50V / 10% / SMD 0603: Capacitor, Ceramic Chip, 100nF (0.1uF), 50V, 5%, SMD 0603 [LCA016]; Value: 100n; FMEDA__OPERATING__VOLTAGE_MIN: 0; FMEDA__OPERATING__VOLTAGE_MAX: 3.3; FMEDA__OPERATING__TEMP_MIN: -20; FMEDA__OPERATING__TEMP_TYP: 27; FMEDA__OPERATING__TEMP_MAX: 50; FMEDA__CHANNEL: COM; FMEDA__FUNCTION_IN_SYSTEM: *; FMEDA__OPERATING__VOLTAGE_TYP: 3.3
C60 = 1uF / 50V / 10% / SMD 0805: Capacitor, Ceramic Chip, 1uF, 50V, SMD 0805 [LCA098]; Value: 1u; FMEDA__OPERATING__VOLTAGE_MAX: 17; FMEDA__OPERATING__VOLTAGE_MIN: 0; FMEDA__OPERATING__TEMP_MAX: 50; FMEDA__OPERATING__TEMP_MIN: -20; FMEDA__OPERATING__TEMP_TYP: 27; FMEDA__OPERATING__VOLTAGE_TYP: 14; FMEDA__FUNCTION_IN_SYSTEM: POWER IN FILTER; FMEDA__CHANNEL: COM
C63 = 470pF / 50V / 10% / X7R / SMD 0603: Capacitor, Ceramic Chip, 470pF, 50V, 10% X7R, SMD 0603 [LCA111]; Value: 470p; FMEDA__OPERATING__TEMP_MAX: 50; FMEDA__OPERATING__TEMP_MIN: -20; FMEDA__OPERATING__TEMP_TYP: 27; FMEDA__OPERATING__VOLTAGE_MAX: 3.3; FMEDA__OPERATING__VOLTAGE_MIN: 0; FMEDA__FUNCTION_IN_SYSTEM: PMIC VSENSE CAP; FMEDA__CHANNEL: COM; FMEDA__OPERATING__VOLTAGE_TYP: 3.3
C67 C68 = 100nF / 50V / 10% / SMD 0603: Capacitor, Ceramic Chip, 100nF (0.1uF), 50V, 5%, SMD 0603 [LCA016]; Value: 100n; FMEDA__OPERATING__TEMP_MAX: 50; FMEDA__OPERATING__TEMP_MIN: -20; FMEDA__OPERATING__TEMP_TYP: 27; FMEDA__OPERATING__VOLTAGE_MAX: 3.3; FMEDA__OPERATING__VOLTAGE_MIN: 0; FMEDA__CHANNEL: COM; FMEDA__OPERATING__VOLTAGE_TYP: 3.3; FMEDA__FUNCTION_IN_SYSTEM: *
C69 = 1uF / 50V / 10% / SMD 0805: Capacitor, Ceramic Chip, 1uF, 50V, SMD 0805 [LCA098]; Value: 1u; FMEDA__OPERATING__VOLTAGE_MAX: 3.3; FMEDA__OPERATING__VOLTAGE_MIN: 0; FMEDA__OPERATING__TEMP_MAX: 50; FMEDA__OPERATING__TEMP_MIN: -20; FMEDA__OPERATING__TEMP_TYP: 27; FMEDA__FUNCTION_IN_SYSTEM: PMIC BOOT CAP; FMEDA__CHANNEL: COM; FMEDA__OPERATING__VOLTAGE_TYP: 3.3
C70 = 1nF / 50V / 10% / SMD 0603: Capacitor, Ceramic Chip, 1nF (1000pF), 50V, 10%, SMD 0603 [LCA015]; Value: 1n; FMEDA__FUNCTION_IN_SYSTEM: ACC BUS IN FILTER; FMEDA__OPERATING__TEMP_MAX: 50; FMEDA__OPERATING__TEMP_MIN: -20; FMEDA__OPERATING__TEMP_TYP: 27; FMEDA__OPERATING__VOLTAGE_MAX: 17; FMEDA__OPERATING__VOLTAGE_MIN: 0; FMEDA__OPERATING__VOLTAGE_TYP: 14; FMEDA__CHANNEL: COM
CE4 = 330uF / 35V / 20% / SMD 10x10: Capacitor, Aluminum Electrolytic, 330uF, 35V, 20%, SMD (10mm x 10mm); FMEDA__OPERATING__TEMP_MAX: 50; FMEDA__OPERATING__TEMP_MIN: -20; FMEDA__OPERATING__TEMP_TYP: 27; FMEDA__OPERATING__VOLTAGE_MAX: 17; FMEDA__OPERATING__VOLTAGE_MIN: 0; FMEDA__OPERATING__VOLTAGE_TYP: 14; Value: 330u; FMEDA__FUNCTION_IN_SYSTEM: POWER IN FILTER CAP; FMEDA__CHANNEL: COM
CE5 = 330uF / 35V / 20% / SMD 10x10: Capacitor, Aluminum Electrolytic, 330uF, 35V, 20%, SMD (10mm x 10mm); FMEDA__OPERATING__TEMP_MAX: 50; FMEDA__OPERATING__TEMP_MIN: -20; FMEDA__OPERATING__TEMP_TYP: 27; FMEDA__OPERATING__VOLTAGE_MAX: 5.3; FMEDA__OPERATING__VOLTAGE_MIN: 0; Value: 330u; FMEDA__FUNCTION_IN_SYSTEM: PMIC 5V3 CAP; FMEDA__CHANNEL: COM; FMEDA__OPERATING__VOLTAGE_TYP: 5.3
CT9 = 22uF / 16V / 10% / SMD TC3528: Capacitor, Tantalum, 22uF, 16V, 10%, SMD TC3528 (BCASE) [LCA039]; Value: 22u; FMEDA__OPERATING__VOLTAGE_MAX: 5.3; FMEDA__OPERATING__VOLTAGE_MIN: 0; FMEDA__OPERATING__TEMP_MAX: 50; FMEDA__OPERATING__TEMP_MIN: -20; FMEDA__OPERATING__TEMP_TYP: 27; FMEDA__FUNCTION_IN_SYSTEM: PMIC 5V3 CAP; FMEDA__CHANNEL: COM; FMEDA__OPERATING__VOLTAGE_TYP: 5.3
CT10 = 22uF / 16V / 10% / SMD TC3528: Capacitor, Tantalum, 22uF, 16V, 10%, SMD TC3528 (BCASE) [LCA039]; Value: 22u; FMEDA__OPERATING__VOLTAGE_MAX: 5; FMEDA__OPERATING__VOLTAGE_MIN: 0; FMEDA__OPERATING__TEMP_MAX: 50; FMEDA__OPERATING__TEMP_MIN: -20; FMEDA__OPERATING__TEMP_TYP: 27; FMEDA__FUNCTION_IN_SYSTEM: PMIC 5V CAP; FMEDA__CHANNEL: COM; FMEDA__OPERATING__VOLTAGE_TYP: 5
CT11 = 22uF / 16V / 10% / SMD TC3528: Capacitor, Tantalum, 22uF, 16V, 10%, SMD TC3528 (BCASE) [LCA039]; Value: 22u; FMEDA__OPERATING__VOLTAGE_MAX: 3.3; FMEDA__OPERATING__VOLTAGE_MIN: 0; FMEDA__OPERATING__TEMP_MAX: 50; FMEDA__OPERATING__TEMP_MIN: -20; FMEDA__OPERATING__TEMP_TYP: 27; FMEDA__FUNCTION_IN_SYSTEM: PMIC 3V3 CAP; FMEDA__CHANNEL: COM; FMEDA__OPERATING__VOLTAGE_TYP: 3.3
CT12 = 22uF / 16V / 10% / SMD TC3528: Capacitor, Tantalum, 22uF, 16V, 10%, SMD TC3528 (BCASE) [LCA039]; Value: 22u; FMEDA__OPERATING__VOLTAGE_MAX: 3.3; FMEDA__OPERATING__VOLTAGE_MIN: 0; FMEDA__OPERATING__TEMP_MAX: 50; FMEDA__OPERATING__TEMP_MIN: -20; FMEDA__OPERATING__TEMP_TYP: 27; FMEDA__OPERATING__VOLTAGE_TYP: 1.2; FMEDA__FUNCTION_IN_SYSTEM: PMIC 1V2 CAP; FMEDA__CHANNEL: COM
D4 = S3M-E3/57T: Diode, General Purpose Rectifier, 3A, 200V, SMD DO-214AB [LIC189]; FMEDA__OPERATING__CURRENT_MAX: 0; FMEDA__OPERATING__TEMP_MAX: 50; FMEDA__OPERATING__TEMP_MIN: -20; FMEDA__OPERATING__TEMP_TYP: 27; FMEDA__FUNCTION_IN_SYSTEM: POWER SYSTEM INPUT DIODE; FMEDA__CHANNEL: COM; FMEDA__OPERATING__CURRENT_MIN: 0; FMEDA__OPERATING__CURRENT_TYP: 0; FMEDA__OPERATING__VOLTAGE_MAX: 0; FMEDA__OPERATING__VOLTAGE_MIN: 0; FMEDA__OPERATING__VOLTAGE_TYP: 0
D5 = SS16: Diode, Schottky Rectifier, 60V, 1A, SMD DO-214AC [LIC367]; FMEDA__FUNCTION_IN_SYSTEM: PMIC PH DIODE; FMEDA__OPERATING__TEMP_MAX: 50; FMEDA__OPERATING__TEMP_MIN: -20; FMEDA__OPERATING__TEMP_TYP: 27; FMEDA__OPERATING__VOLTAGE_MAX: 0; FMEDA__CHANNEL: COM; FMEDA__OPERATING__VOLTAGE_MIN: 0; FMEDA__OPERATING__VOLTAGE_TYP: 0; FMEDA__OPERATING__CURRENT_MAX: 0; FMEDA__OPERATING__CURRENT_MIN: 0; FMEDA__OPERATING__CURRENT_TYP: 0
IC16 = TPS65300QPWPRQ1: IC, Power Management IC, SMD [LIC364]; FMEDA__FUNCTION_IN_SYSTEM: PMIC CONTROLLER; FMEDA__OPERATING__TEMP_MAX: 50; FMEDA__OPERATING__TEMP_MIN: -20; FMEDA__OPERATING__TEMP_TYP: 27; FMEDA__CHANNEL: COM
L2 = MSS1278T-103MLB: Inductor, 10uH, 20%, 5.7A, SMD [LIN031]; FMEDA__OPERATING__TEMP_MAX: 50; FMEDA__OPERATING__TEMP_MIN: -20; FMEDA__OPERATING__TEMP_TYP: 27; Value: 10u; FMEDA__CHANNEL: COM; Revision: 1; FMEDA__FUNCTION_IN_SYSTEM: *
Q1 = PBSS4021NZ,115: Transistor, NPN, 20V 8A 770mW 95MHz, SMD [LIC366]; FMEDA__FUNCTION_IN_SYSTEM: PMIC 3V3 TRANSISTOR; FMEDA__OPERATING__TEMP_MAX: 50; FMEDA__OPERATING__TEMP_MIN: -20; FMEDA__OPERATING__TEMP_TYP: 27; FMEDA__CHANNEL: COM
Q2 = PBSS4021NZ,115: Transistor, NPN, 20V 8A 770mW 95MHz, SMD [LIC366]; FMEDA__FUNCTION_IN_SYSTEM: PMIC 1V2 TRANSISTOR; FMEDA__OPERATING__TEMP_MAX: 50; FMEDA__OPERATING__TEMP_MIN: -20; FMEDA__OPERATING__TEMP_TYP: 27; FMEDA__CHANNEL: COM
R23 = 30K / 0.1W / 1% / SMD 0603: Resistor, Ceramic Chip, 30K, 0.1W, 1%, SMD 0603 [LRE120]; FMEDA__FUNCTION_IN_SYSTEM: PMIC COMP RESISTOR; FMEDA__OPERATING__POWER_MAX: 0; FMEDA__OPERATING__TEMP_MAX: 50; FMEDA__OPERATING__TEMP_MIN: -20; FMEDA__OPERATING__TEMP_TYP: 27; FMEDA__CHANNEL: COM; Value: 30K; FMEDA__OPERATING__POWER_MIN: 0; FMEDA__OPERATING__VOLTAGE_MAX: 0; FMEDA__OPERATING__VOLTAGE_MIN: 0; FMEDA__OPERATING__VOLTAGE_TYP: 0
R24 = 10K / 0.1W / 1% / SMD 0603: Resistor, Ceramic Chip, 10K, 0.1W, 1%, SMD 0603 [LRE030]; FMEDA__OPERATING__POWER_MAX: 0; FMEDA__OPERATING__VOLTAGE_MAX: 3.3; FMEDA__OPERATING__TEMP_MAX: 50; FMEDA__OPERATING__TEMP_MIN: -20; FMEDA__OPERATING__TEMP_TYP: 27; FMEDA__FUNCTION_IN_SYSTEM: RESET PULLUP; FMEDA__CHANNEL: COM; Value: 10K; FMEDA__OPERATING__POWER_MIN: 0; FMEDA__OPERATING__VOLTAGE_MIN: 0; FMEDA__OPERATING__VOLTAGE_TYP: 3.3
R25 = 10K / 0.1W / 1% / SMD 0603: Resistor, Ceramic Chip, 10K, 0.1W, 1%, SMD 0603 [LRE030]; FMEDA__OPERATING__POWER_MAX: 0; FMEDA__OPERATING__VOLTAGE_MAX: 3.3; FMEDA__OPERATING__TEMP_MAX: 50; FMEDA__OPERATING__TEMP_MIN: -20; FMEDA__OPERATING__TEMP_TYP: 27; FMEDA__FUNCTION_IN_SYSTEM: PMIC IGN PULLUP; FMEDA__CHANNEL: COM; Value: 10K; FMEDA__OPERATING__POWER_MIN: 0; FMEDA__OPERATING__VOLTAGE_MIN: 0; FMEDA__OPERATING__VOLTAGE_TYP: 3.3
R26 = 30K / 0.1W / 1% / SMD 0603: Resistor, Ceramic Chip, 30K, 0.1W, 1%, SMD 0603 [LRE120]; FMEDA__FUNCTION_IN_SYSTEM: PMIC RESISTOR; FMEDA__OPERATING__POWER_MAX: 0; FMEDA__OPERATING__TEMP_MAX: 50; FMEDA__OPERATING__TEMP_MIN: -20; FMEDA__OPERATING__TEMP_TYP: 27; FMEDA__CHANNEL: COM; Value: 30K; FMEDA__OPERATING__POWER_MIN: 0; FMEDA__OPERATING__VOLTAGE_MAX: 0; FMEDA__OPERATING__VOLTAGE_MIN: 0; FMEDA__OPERATING__VOLTAGE_TYP: 0
R27 = 18K / 0.1W / 1% / SMD 0603: Resistor, Ceramic Chip, 18K, 0.1W, 1%, SMD 0603 [LRE176]; FMEDA__OPERATING__POWER_MAX: 0; FMEDA__OPERATING__TEMP_MAX: 50; FMEDA__OPERATING__TEMP_MIN: -20; FMEDA__OPERATING__TEMP_TYP: 27; FMEDA__CHANNEL: COM; Value: 18K; FMEDA__OPERATING__POWER_MIN: 0; FMEDA__OPERATING__VOLTAGE_MAX: 0; FMEDA__OPERATING__VOLTAGE_MIN: 0; FMEDA__OPERATING__VOLTAGE_TYP: 0; FMEDA__FUNCTION_IN_SYSTEM: *
R28 = 30K / 0.1W / 1% / SMD 0603: Resistor, Ceramic Chip, 30K, 0.1W, 1%, SMD 0603 [LRE120]; FMEDA__FUNCTION_IN_SYSTEM: ACC BUS IN FILTER; FMEDA__OPERATING__POWER_MAX: 0; FMEDA__OPERATING__TEMP_MAX: 50; FMEDA__OPERATING__TEMP_MIN: -20; FMEDA__OPERATING__TEMP_TYP: 27; FMEDA__OPERATING__VOLTAGE_MAX: 17; FMEDA__OPERATING__VOLTAGE_TYP: 14; FMEDA__CHANNEL: COM; Value: 30K; FMEDA__OPERATING__POWER_MIN: 0; FMEDA__OPERATING__VOLTAGE_MIN: 0
R29 = 5K6 / 0.1W / 1% / SMD 0603: Resistor, Ceramic Chip, 5.6K, 0.1W, 1%, SMD 0603 [LRE028]; FMEDA__OPERATING__POWER_MAX: 0; FMEDA__OPERATING__TEMP_MAX: 50; FMEDA__OPERATING__TEMP_MIN: -20; FMEDA__OPERATING__TEMP_TYP: 27; FMEDA__OPERATING__VOLTAGE_MAX: 17; FMEDA__OPERATING__VOLTAGE_TYP: 14; FMEDA__FUNCTION_IN_SYSTEM: ACC BUS IN FILTER; FMEDA__CHANNEL: COM; Value: 5.6K; FMEDA__OPERATING__POWER_MIN: 0; FMEDA__OPERATING__VOLTAGE_MIN: 0
TP14-TP21 = SMD_TP_SMALL: SMD Test Point; FMEDA__CHANNEL: COM; FMEDA__OPERATING__CURRENT_MAX: 0; FMEDA__OPERATING__TEMP_MAX: 50; FMEDA__OPERATING__TEMP_MIN: -20; FMEDA__OPERATING__TEMP_TYP: 27; FMEDA__OPERATING__VOLTAGE_MAX: 16; FMEDA__OPERATING__VOLTAGE_TYP: 12; FMEDA__OPERATING__CURRENT_MIN: 0; FMEDA__OPERATING__CURRENT_TYP: 0; FMEDA__OPERATING__VOLTAGE_MIN: 0

## Sheet LPCB235 - IO Connector.SchDoc
size A3; Address1: Unit 4; DocumentNumber: 15; Revision: 2; SheetNumber: 15; SheetTotal: 37; Lockie__PCB_SUB_ASSEMBLY: IO Connector; Lockie__PCB_ASSEMBLY: FCU PCB; Lockie__LDL: LPCB235; Lockie__PCB_DESCRIPTION: Flight Control Unit; PageSetup: Record=PageOptions|CenterHorizontal=True|CenterVertical=True|PrintScale=1.02|XCorrection=1.00|YCorrection=1.00|PrintKind=1|BorderSize=5000000|LeftOffset=0|BottomOffset=0|Orientation=2|PaperLength=4200|PaperWidth=2970|Scale=100|PaperSource=7|PrintQuality=-4|MediaType=1|DitherType=10|PaperKind=A3 (297 x 420 mm)|PrintScaleMode=1
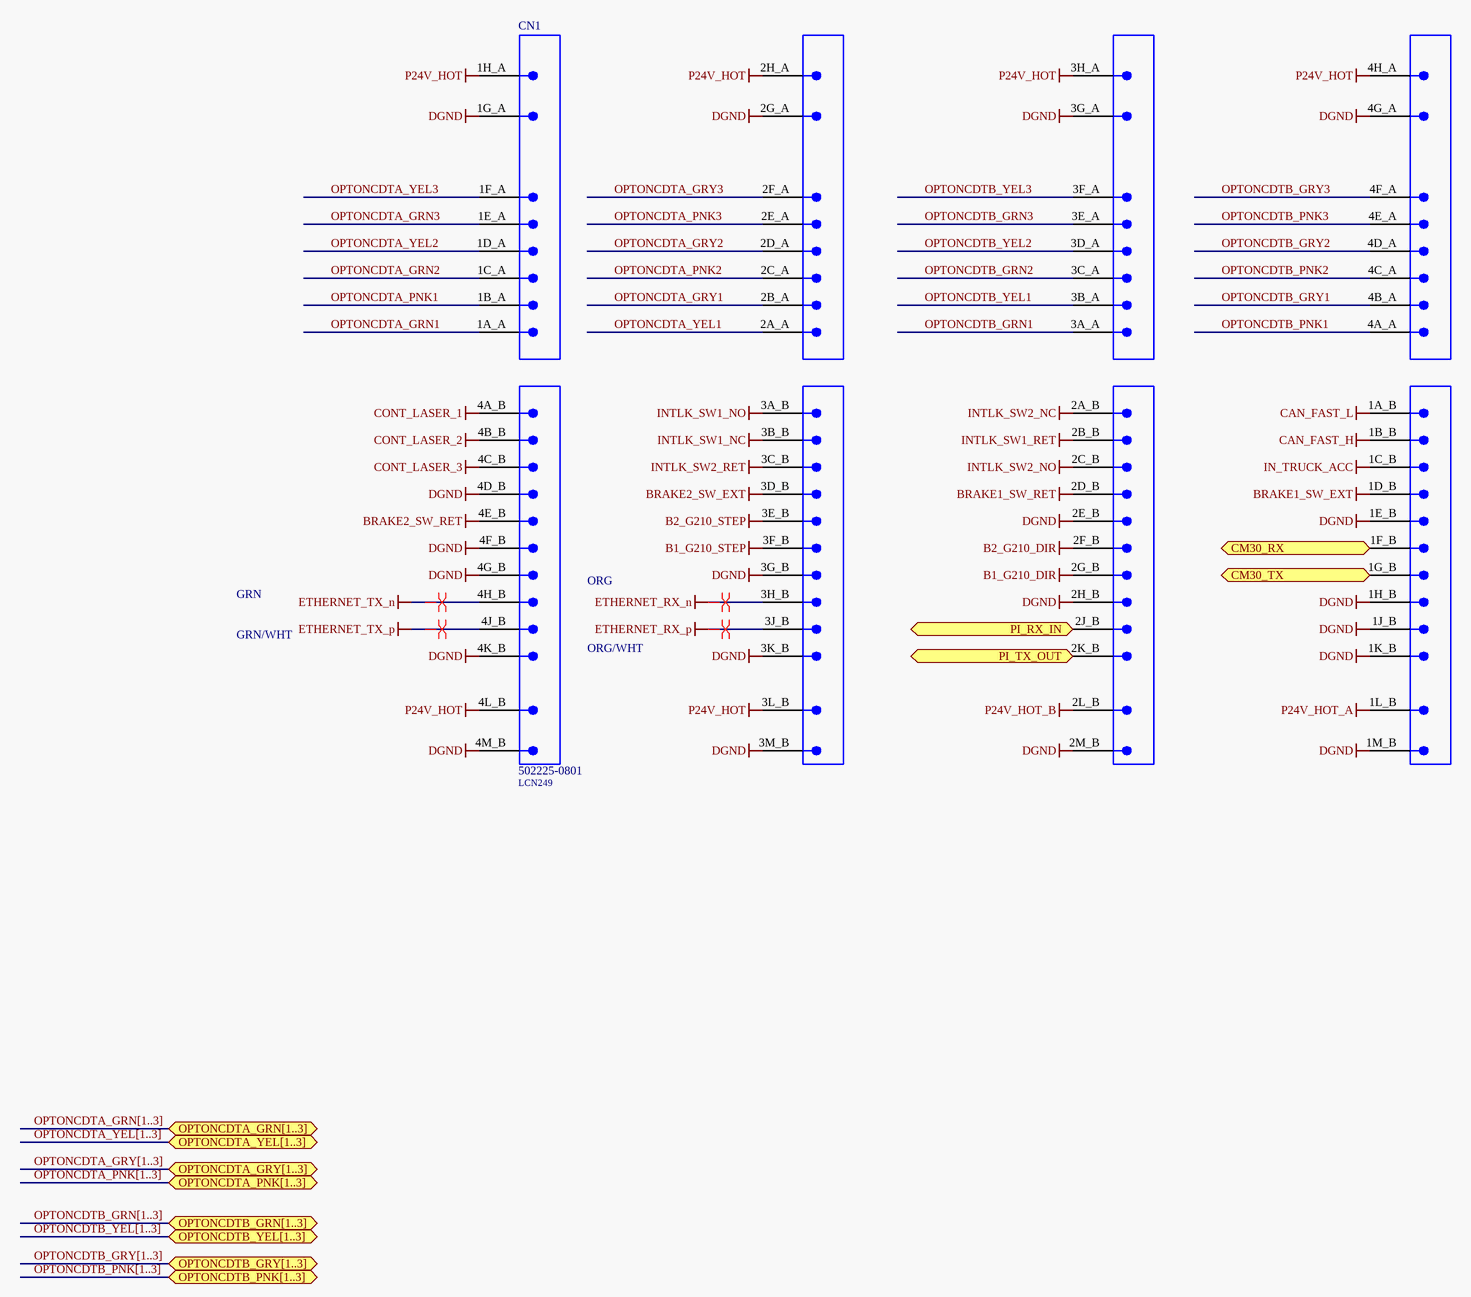
[diagram p2: LPCB235 - IO Connector.SchDoc]

### Parts
CN1  502225-0801  LDL_NUMBER: LCN249  [502225-0801]

### Ports
CM30_RX (out), CM30_TX (in), OPTONCDTA_GRN[1..3] (bidir), OPTONCDTA_GRY[1..3] (bidir), OPTONCDTA_PNK[1..3] (bidir), OPTONCDTA_YEL[1..3] (bidir), OPTONCDTB_GRN[1..3] (bidir), OPTONCDTB_GRY[1..3] (bidir), OPTONCDTB_PNK[1..3] (bidir), OPTONCDTB_YEL[1..3] (bidir), PI_RX_IN (out), PI_TX_OUT (in)

### Nets
B1_G210_DIR: CN1.2G_B
B1_G210_STEP: CN1.3F_B
B2_G210_DIR: CN1.2F_B
B2_G210_STEP: CN1.3E_B
BRAKE1_SW_EXT: CN1.1D_B
BRAKE1_SW_RET: CN1.2D_B
BRAKE2_SW_EXT: CN1.3D_B
BRAKE2_SW_RET: CN1.4E_B
CAN_FAST_H: CN1.1B_B
CAN_FAST_L: CN1.1A_B
CONT_LASER_1: CN1.4A_B
CONT_LASER_2: CN1.4B_B
CONT_LASER_3: CN1.4C_B
DGND: CN1.1E_B CN1.1G_A(1G) CN1.1H_B CN1.1J_B CN1.1K_B CN1.1M_B CN1.2E_B CN1.2G_A(2G) CN1.2H_B CN1.2M_B CN1.3G_A(3G) CN1.3G_B CN1.3K_B CN1.3M_B CN1.4D_B CN1.4F_B CN1.4G_A(4G) CN1.4G_B CN1.4K_B CN1.4M_B
ETHERNET_RX_n: CN1.3H_B
ETHERNET_RX_p: CN1.3J_B
ETHERNET_TX_n: CN1.4H_B
ETHERNET_TX_p: CN1.4J_B
IN_TRUCK_ACC: CN1.1C_B
INTLK_SW1_NC: CN1.3B_B
INTLK_SW1_NO: CN1.3A_B
INTLK_SW1_RET: CN1.2B_B
INTLK_SW2_NC: CN1.2A_B
INTLK_SW2_NO: CN1.2C_B
INTLK_SW2_RET: CN1.3C_B
P24V_HOT: CN1.1H_A(1H) CN1.2H_A(2H) CN1.3H_A(3H) CN1.3L_B CN1.4H_A(4H) CN1.4L_B
P24V_HOT_A: CN1.1L_B
P24V_HOT_B: CN1.2L_B
CM30_RX: CN1.1F_B ; port CM30_RX
CM30_TX: CN1.1G_B ; port CM30_TX
OPTONCDTA_GRN1: CN1.1A_A(1A)
OPTONCDTA_GRN2: CN1.1C_A(1C)
OPTONCDTA_GRN3: CN1.1E_A(1E)
OPTONCDTA_GRY1: CN1.2B_A(2B)
OPTONCDTA_GRY2: CN1.2D_A(2D)
OPTONCDTA_GRY3: CN1.2F_A(2F)
OPTONCDTA_PNK1: CN1.1B_A(1B)
OPTONCDTA_PNK2: CN1.2C_A(2C)
OPTONCDTA_PNK3: CN1.2E_A(2E)
OPTONCDTA_YEL1: CN1.2A_A(2A)
OPTONCDTA_YEL2: CN1.1D_A(1D)
OPTONCDTA_YEL3: CN1.1F_A(1F)
OPTONCDTB_GRN1: CN1.3A_A(3A)
OPTONCDTB_GRN2: CN1.3C_A(3C)
OPTONCDTB_GRN3: CN1.3E_A(3E)
OPTONCDTB_GRY1: CN1.4B_A(4B)
OPTONCDTB_GRY2: CN1.4D_A(4D)
OPTONCDTB_GRY3: CN1.4F_A(4F)
OPTONCDTB_PNK1: CN1.4A_A(4A)
OPTONCDTB_PNK2: CN1.4C_A(4C)
OPTONCDTB_PNK3: CN1.4E_A(4E)
OPTONCDTB_YEL1: CN1.3B_A(3B)
OPTONCDTB_YEL2: CN1.3D_A(3D)
OPTONCDTB_YEL3: CN1.3F_A(3F)
PI_RX_IN: CN1.2J_B ; port PI_RX_IN
PI_TX_OUT: CN1.2K_B ; port PI_TX_OUT

### Buses and harness runs
bus OPTONCDTA_GRN[1..3] = port OPTONCDTA_GRN[1..3]
bus OPTONCDTA_GRY[1..3] = port OPTONCDTA_GRY[1..3]
bus OPTONCDTA_PNK[1..3] = port OPTONCDTA_PNK[1..3]
bus OPTONCDTA_YEL[1..3] = port OPTONCDTA_YEL[1..3]
bus OPTONCDTB_GRN[1..3] = port OPTONCDTB_GRN[1..3]
bus OPTONCDTB_GRY[1..3] = port OPTONCDTB_GRY[1..3]
bus OPTONCDTB_PNK[1..3] = port OPTONCDTB_PNK[1..3]
bus OPTONCDTB_YEL[1..3] = port OPTONCDTB_YEL[1..3]

### Layout directives
differential pair: ETHERNET_RX_n, ETHERNET_RX_p, ETHERNET_TX_n, ETHERNET_TX_p

### Notes on the sheet
- GRN/WHT
- GRN
- (near CN1) ORG
- (near CN1) ORG/WHT
- PCB COMPONENT DESCRIPTION
- LDL NUMBER
- Assembly Details
- Size
- Drawing File Name
- Revision
- http://rloop.org
- Scale
- A3
- Sheet Details
- N.T.S
- Sheet:
- Of:

### Library data of the parts
CN1 = 502225-0801: Connector, Molex CMC, Automotive Socket, 80 Circuits, 2 Pockets; FMEDA__FUNCTION_IN_SYSTEM: IO CONNECTOR; FMEDA__CHANNEL: COM; FMEDA__OPERATING__CURRENT_MAX: 0; FMEDA__OPERATING__TEMP_MAX: 50; FMEDA__OPERATING__TEMP_MIN: -20; FMEDA__OPERATING__TEMP_TYP: 27; FMEDA__OPERATING__VOLTAGE_MAX: 16; FMEDA__OPERATING__VOLTAGE_TYP: 12; FMEDA__OPERATING__CURRENT_MIN: 0; FMEDA__OPERATING__CURRENT_TYP: 0; FMEDA__OPERATING__VOLTAGE_MIN: 0

## Sheet LPCB235 - RM48 - OVERVIEW.SchDoc
size A3; Address1: Unit 4; DocumentNumber: 21; Revision: 2; SheetNumber: 21; SheetTotal: 37; Lockie__PCB_SUB_ASSEMBLY: CPU Overview; Lockie__PCB_ASSEMBLY: FCU PCB; Lockie__LDL: LPCB235; Lockie__PCB_DESCRIPTION: Flight Control Unit
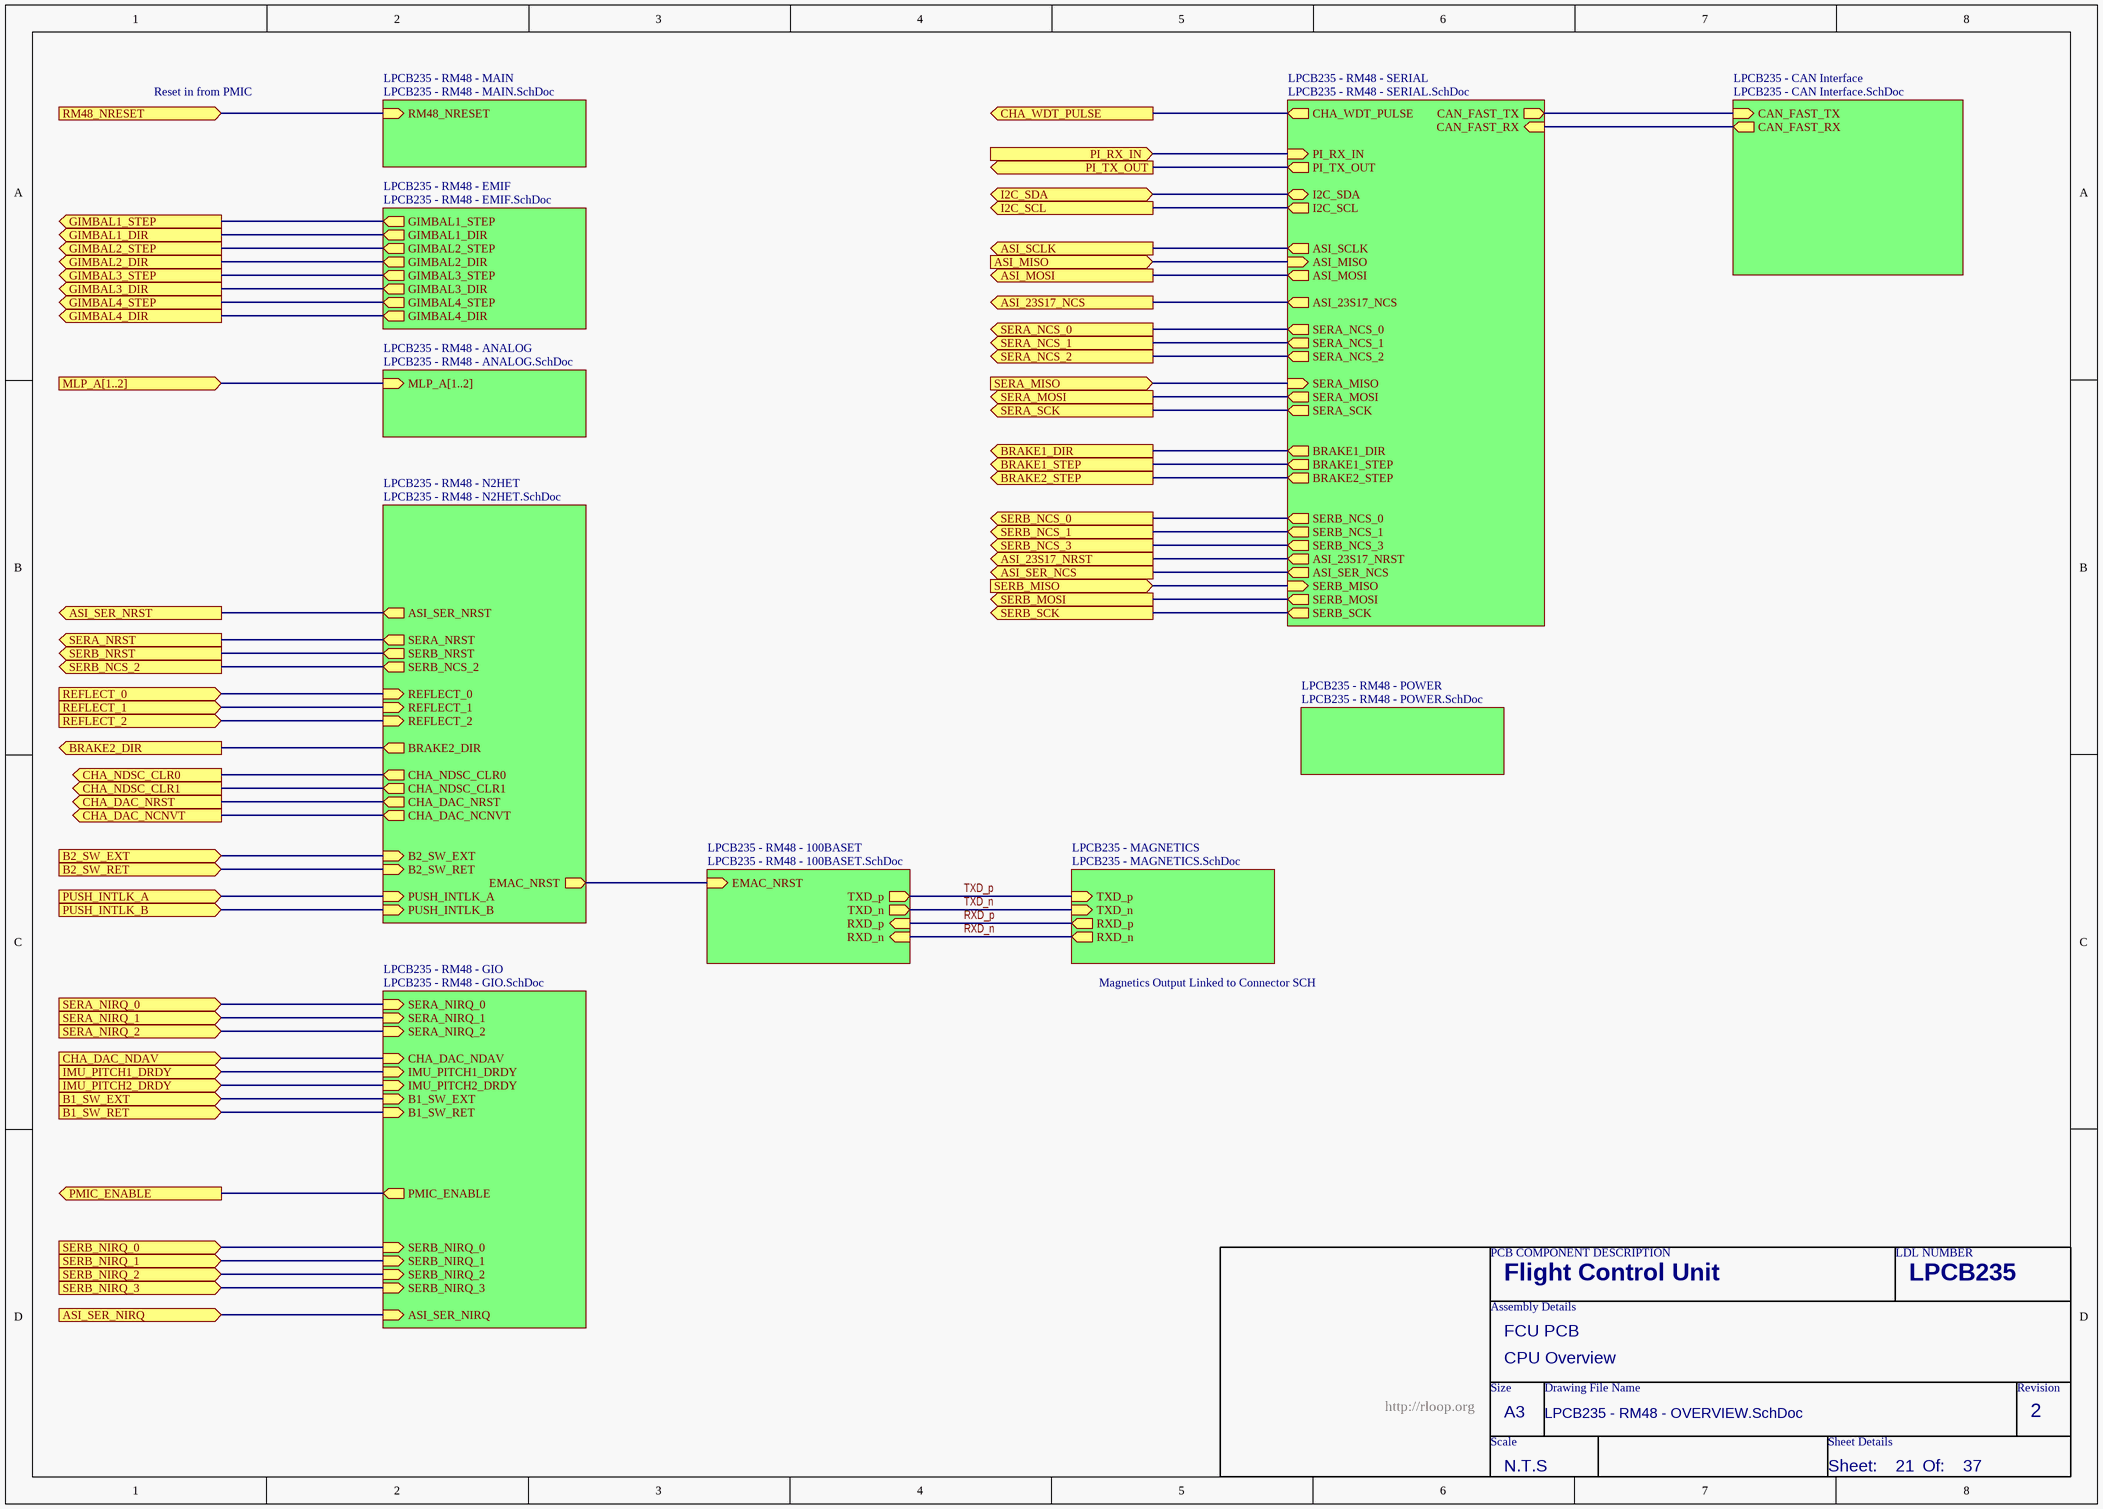
[diagram p3: LPCB235 - RM48 - OVERVIEW.SchDoc]

### Sub-sheets
LPCB235 - CAN Interface = LPCB235 - CAN Interface.SchDoc: CAN_FAST_TX (in), CAN_FAST_RX (out)
LPCB235 - MAGNETICS = LPCB235 - MAGNETICS.SchDoc: TXD_p (in), TXD_n (in), RXD_p (out), RXD_n (out)
LPCB235 - RM48 - 100BASET = LPCB235 - RM48 - 100BASET.SchDoc: TXD_p (out), TXD_n (out), RXD_p (in), RXD_n (in), EMAC_NRST (in)
LPCB235 - RM48 - ANALOG = LPCB235 - RM48 - ANALOG.SchDoc: MLP_A[1..2] (in)
LPCB235 - RM48 - EMIF = LPCB235 - RM48 - EMIF.SchDoc: GIMBAL1_STEP (out), GIMBAL1_DIR (out), GIMBAL2_STEP (out), GIMBAL2_DIR (out), GIMBAL3_STEP (out), GIMBAL3_DIR (out), GIMBAL4_STEP (out), GIMBAL4_DIR (out)
LPCB235 - RM48 - GIO = LPCB235 - RM48 - GIO.SchDoc: SERA_NIRQ_0 (in), SERA_NIRQ_1 (in), SERA_NIRQ_2 (in), IMU_PITCH1_DRDY (in), CHA_DAC_NDAV (in), IMU_PITCH2_DRDY (in), PMIC_ENABLE (out), B1_SW_EXT (in), B1_SW_RET (in), SERB_NIRQ_0 (in), SERB_NIRQ_1 (in), SERB_NIRQ_2 (in), SERB_NIRQ_3 (in), ASI_SER_NIRQ (in)
LPCB235 - RM48 - MAIN = LPCB235 - RM48 - MAIN.SchDoc: RM48_NRESET (in)
LPCB235 - RM48 - N2HET = LPCB235 - RM48 - N2HET.SchDoc: SERA_NRST (out), SERB_NRST (out), REFLECT_0 (in), REFLECT_1 (in), REFLECT_2 (in), BRAKE2_DIR (out), PUSH_INTLK_A (in), EMAC_NRST (out), B2_SW_EXT (in), SERB_NCS_2 (out), PUSH_INTLK_B (in), B2_SW_RET (in), CHA_NDSC_CLR0 (out), CHA_NDSC_CLR1 (out), CHA_DAC_NRST (out), CHA_DAC_NCNVT (out), ASI_SER_NRST (out)
LPCB235 - RM48 - POWER = LPCB235 - RM48 - POWER.SchDoc: no entries
LPCB235 - RM48 - SERIAL = LPCB235 - RM48 - SERIAL.SchDoc: CAN_FAST_TX (out), CAN_FAST_RX (in), ASI_SCLK (out), ASI_MOSI (out), ASI_MISO (in), CHA_WDT_PULSE (out), SERA_SCK (out), SERA_MOSI (out), SERA_MISO (in), SERA_NCS_0 (out), SERA_NCS_1 (out), SERA_NCS_2 (out), SERB_MISO (in), SERB_MOSI (out), SERB_SCK (out), BRAKE2_STEP (out), BRAKE1_STEP (out), BRAKE1_DIR (out), SERB_NCS_0 (out), SERB_NCS_1 (out), I2C_SDA (bidir), I2C_SCL (out), SERB_NCS_3 (out), ASI_23S17_NRST (out), ASI_SER_NCS (out), PI_RX_IN (in), PI_TX_OUT (out), ASI_23S17_NCS (out)

### Ports
ASI_23S17_NCS (out), ASI_23S17_NRST (out), ASI_MISO (in), ASI_MOSI (out), ASI_SCLK (out), ASI_SER_NCS (out), ASI_SER_NIRQ (in), ASI_SER_NRST (out), B1_SW_EXT (in), B1_SW_RET (in), B2_SW_EXT (in), B2_SW_RET (in), BRAKE1_DIR (out), BRAKE1_STEP (out), BRAKE2_DIR (out), BRAKE2_STEP (out), CHA_DAC_NCNVT (out), CHA_DAC_NDAV (in), CHA_DAC_NRST (out), CHA_NDSC_CLR0 (out), CHA_NDSC_CLR1 (out), CHA_WDT_PULSE (out), GIMBAL1_DIR (out), GIMBAL1_STEP (out), GIMBAL2_DIR (out), GIMBAL2_STEP (out), GIMBAL3_DIR (out), GIMBAL3_STEP (out), GIMBAL4_DIR (out), GIMBAL4_STEP (out), I2C_SCL (out), I2C_SDA (bidir), IMU_PITCH1_DRDY (in), IMU_PITCH2_DRDY (in), MLP_A[1..2] (in), PI_RX_IN (in), PI_TX_OUT (out), PMIC_ENABLE (out), PUSH_INTLK_A (in), PUSH_INTLK_B (in), REFLECT_0 (in), REFLECT_1 (in), REFLECT_2 (in), RM48_NRESET (in), SERA_MISO (in), SERA_MOSI (out), SERA_NCS_0 (out), SERA_NCS_1 (out), SERA_NCS_2 (out), SERA_NIRQ_0 (in), SERA_NIRQ_1 (in), SERA_NIRQ_2 (in), SERA_NRST (out), SERA_SCK (out), SERB_MISO (in), SERB_MOSI (out), SERB_NCS_0 (out), SERB_NCS_1 (out), SERB_NCS_2 (out), SERB_NCS_3 (out), SERB_NIRQ_0 (in), SERB_NIRQ_1 (in), SERB_NIRQ_2 (in), SERB_NIRQ_3 (in), SERB_NRST (out), SERB_SCK (out)

### Nets
ASI_23S17_NCS: port ASI_23S17_NCS, sheet LPCB235 - RM48 - SERIAL/ASI_23S17_NCS
ASI_23S17_NRST: port ASI_23S17_NRST, sheet LPCB235 - RM48 - SERIAL/ASI_23S17_NRST
ASI_MISO: port ASI_MISO, sheet LPCB235 - RM48 - SERIAL/ASI_MISO
ASI_MOSI: port ASI_MOSI, sheet LPCB235 - RM48 - SERIAL/ASI_MOSI
ASI_SCLK: port ASI_SCLK, sheet LPCB235 - RM48 - SERIAL/ASI_SCLK
ASI_SER_NCS: port ASI_SER_NCS, sheet LPCB235 - RM48 - SERIAL/ASI_SER_NCS
ASI_SER_NIRQ: port ASI_SER_NIRQ, sheet LPCB235 - RM48 - GIO/ASI_SER_NIRQ
ASI_SER_NRST: port ASI_SER_NRST, sheet LPCB235 - RM48 - N2HET/ASI_SER_NRST
B1_SW_EXT: port B1_SW_EXT, sheet LPCB235 - RM48 - GIO/B1_SW_EXT
B1_SW_RET: port B1_SW_RET, sheet LPCB235 - RM48 - GIO/B1_SW_RET
B2_SW_EXT: port B2_SW_EXT, sheet LPCB235 - RM48 - N2HET/B2_SW_EXT
B2_SW_RET: port B2_SW_RET, sheet LPCB235 - RM48 - N2HET/B2_SW_RET
BRAKE1_DIR: port BRAKE1_DIR, sheet LPCB235 - RM48 - SERIAL/BRAKE1_DIR
BRAKE1_STEP: port BRAKE1_STEP, sheet LPCB235 - RM48 - SERIAL/BRAKE1_STEP
BRAKE2_DIR: port BRAKE2_DIR, sheet LPCB235 - RM48 - N2HET/BRAKE2_DIR
BRAKE2_STEP: port BRAKE2_STEP, sheet LPCB235 - RM48 - SERIAL/BRAKE2_STEP
CAN_FAST_RX: sheet LPCB235 - CAN Interface/CAN_FAST_RX, sheet LPCB235 - RM48 - SERIAL/CAN_FAST_RX
CAN_FAST_TX: sheet LPCB235 - CAN Interface/CAN_FAST_TX, sheet LPCB235 - RM48 - SERIAL/CAN_FAST_TX
CHA_DAC_NCNVT: port CHA_DAC_NCNVT, sheet LPCB235 - RM48 - N2HET/CHA_DAC_NCNVT
CHA_DAC_NDAV: port CHA_DAC_NDAV, sheet LPCB235 - RM48 - GIO/CHA_DAC_NDAV
CHA_DAC_NRST: port CHA_DAC_NRST, sheet LPCB235 - RM48 - N2HET/CHA_DAC_NRST
CHA_NDSC_CLR0: port CHA_NDSC_CLR0, sheet LPCB235 - RM48 - N2HET/CHA_NDSC_CLR0
CHA_NDSC_CLR1: port CHA_NDSC_CLR1, sheet LPCB235 - RM48 - N2HET/CHA_NDSC_CLR1
CHA_WDT_PULSE: port CHA_WDT_PULSE, sheet LPCB235 - RM48 - SERIAL/CHA_WDT_PULSE
I2C_SCL: port I2C_SCL, sheet LPCB235 - RM48 - SERIAL/I2C_SCL
I2C_SDA: port I2C_SDA, sheet LPCB235 - RM48 - SERIAL/I2C_SDA
IMU_PITCH1_DRDY: port IMU_PITCH1_DRDY, sheet LPCB235 - RM48 - GIO/IMU_PITCH1_DRDY
IMU_PITCH2_DRDY: port IMU_PITCH2_DRDY, sheet LPCB235 - RM48 - GIO/IMU_PITCH2_DRDY
PI_RX_IN: port PI_RX_IN, sheet LPCB235 - RM48 - SERIAL/PI_RX_IN
PI_TX_OUT: port PI_TX_OUT, sheet LPCB235 - RM48 - SERIAL/PI_TX_OUT
PMIC_ENABLE: port PMIC_ENABLE, sheet LPCB235 - RM48 - GIO/PMIC_ENABLE
PUSH_INTLK_A: port PUSH_INTLK_A, sheet LPCB235 - RM48 - N2HET/PUSH_INTLK_A
PUSH_INTLK_B: port PUSH_INTLK_B, sheet LPCB235 - RM48 - N2HET/PUSH_INTLK_B
REFLECT_0: port REFLECT_0, sheet LPCB235 - RM48 - N2HET/REFLECT_0
REFLECT_1: port REFLECT_1, sheet LPCB235 - RM48 - N2HET/REFLECT_1
REFLECT_2: port REFLECT_2, sheet LPCB235 - RM48 - N2HET/REFLECT_2
RM48_NRESET: port RM48_NRESET, sheet LPCB235 - RM48 - MAIN/RM48_NRESET
RXD_n: sheet LPCB235 - RM48 - 100BASET/RXD_n, sheet LPCB235 - MAGNETICS/RXD_n
RXD_p: sheet LPCB235 - RM48 - 100BASET/RXD_p, sheet LPCB235 - MAGNETICS/RXD_p
SERA_MISO: port SERA_MISO, sheet LPCB235 - RM48 - SERIAL/SERA_MISO
SERA_MOSI: port SERA_MOSI, sheet LPCB235 - RM48 - SERIAL/SERA_MOSI
SERA_NCS_0: port SERA_NCS_0, sheet LPCB235 - RM48 - SERIAL/SERA_NCS_0
SERA_NCS_1: port SERA_NCS_1, sheet LPCB235 - RM48 - SERIAL/SERA_NCS_1
SERA_NCS_2: port SERA_NCS_2, sheet LPCB235 - RM48 - SERIAL/SERA_NCS_2
SERA_NIRQ_0: port SERA_NIRQ_0, sheet LPCB235 - RM48 - GIO/SERA_NIRQ_0
SERA_NIRQ_1: port SERA_NIRQ_1, sheet LPCB235 - RM48 - GIO/SERA_NIRQ_1
SERA_NIRQ_2: port SERA_NIRQ_2, sheet LPCB235 - RM48 - GIO/SERA_NIRQ_2
SERA_NRST: port SERA_NRST, sheet LPCB235 - RM48 - N2HET/SERA_NRST
SERA_SCK: port SERA_SCK, sheet LPCB235 - RM48 - SERIAL/SERA_SCK
SERB_MISO: port SERB_MISO, sheet LPCB235 - RM48 - SERIAL/SERB_MISO
SERB_MOSI: port SERB_MOSI, sheet LPCB235 - RM48 - SERIAL/SERB_MOSI
SERB_NCS_0: port SERB_NCS_0, sheet LPCB235 - RM48 - SERIAL/SERB_NCS_0
SERB_NCS_1: port SERB_NCS_1, sheet LPCB235 - RM48 - SERIAL/SERB_NCS_1
SERB_NCS_2: port SERB_NCS_2, sheet LPCB235 - RM48 - N2HET/SERB_NCS_2
SERB_NCS_3: port SERB_NCS_3, sheet LPCB235 - RM48 - SERIAL/SERB_NCS_3
SERB_NIRQ_0: port SERB_NIRQ_0, sheet LPCB235 - RM48 - GIO/SERB_NIRQ_0
SERB_NIRQ_1: port SERB_NIRQ_1, sheet LPCB235 - RM48 - GIO/SERB_NIRQ_1
SERB_NIRQ_2: port SERB_NIRQ_2, sheet LPCB235 - RM48 - GIO/SERB_NIRQ_2
SERB_NIRQ_3: port SERB_NIRQ_3, sheet LPCB235 - RM48 - GIO/SERB_NIRQ_3
SERB_NRST: port SERB_NRST, sheet LPCB235 - RM48 - N2HET/SERB_NRST
SERB_SCK: port SERB_SCK, sheet LPCB235 - RM48 - SERIAL/SERB_SCK
TXD_n: sheet LPCB235 - RM48 - 100BASET/TXD_n, sheet LPCB235 - MAGNETICS/TXD_n
TXD_p: sheet LPCB235 - RM48 - 100BASET/TXD_p, sheet LPCB235 - MAGNETICS/TXD_p
NetIC14_C4: port GIMBAL2_STEP, sheet LPCB235 - RM48 - EMIF/GIMBAL2_STEP
NetIC14_C5: port GIMBAL2_DIR, sheet LPCB235 - RM48 - EMIF/GIMBAL2_DIR
NetIC14_C6: port GIMBAL3_STEP, sheet LPCB235 - RM48 - EMIF/GIMBAL3_STEP
NetIC14_D4: port GIMBAL1_STEP, sheet LPCB235 - RM48 - EMIF/GIMBAL1_STEP
NetIC14_D5: port GIMBAL1_DIR, sheet LPCB235 - RM48 - EMIF/GIMBAL1_DIR
NetIC14_D16: port GIMBAL3_DIR, sheet LPCB235 - RM48 - EMIF/GIMBAL3_DIR
NetIC14_K17: port GIMBAL4_DIR, sheet LPCB235 - RM48 - EMIF/GIMBAL4_DIR
NetIC14_K18: sheet LPCB235 - RM48 - 100BASET/EMAC_NRST, sheet LPCB235 - RM48 - N2HET/EMAC_NRST
NetIC14_N17: port GIMBAL4_STEP, sheet LPCB235 - RM48 - EMIF/GIMBAL4_STEP

### Buses and harness runs
bus port MLP_A[1..2] = sheet LPCB235 - RM48 - ANALOG/MLP_A[1..2]

### Notes on the sheet
- Reset in from PMIC
- Magnetics Output Linked to Connector SCH
- PCB COMPONENT DESCRIPTION
- LDL NUMBER
- Assembly Details
- Size
- Drawing File Name
- Revision
- http://rloop.org
- Scale
- A3
- Sheet Details
- N.T.S
- Sheet:
- Of: